# EAGLE design VIC-MIDI_v1.0a (EAGLE 5.11)
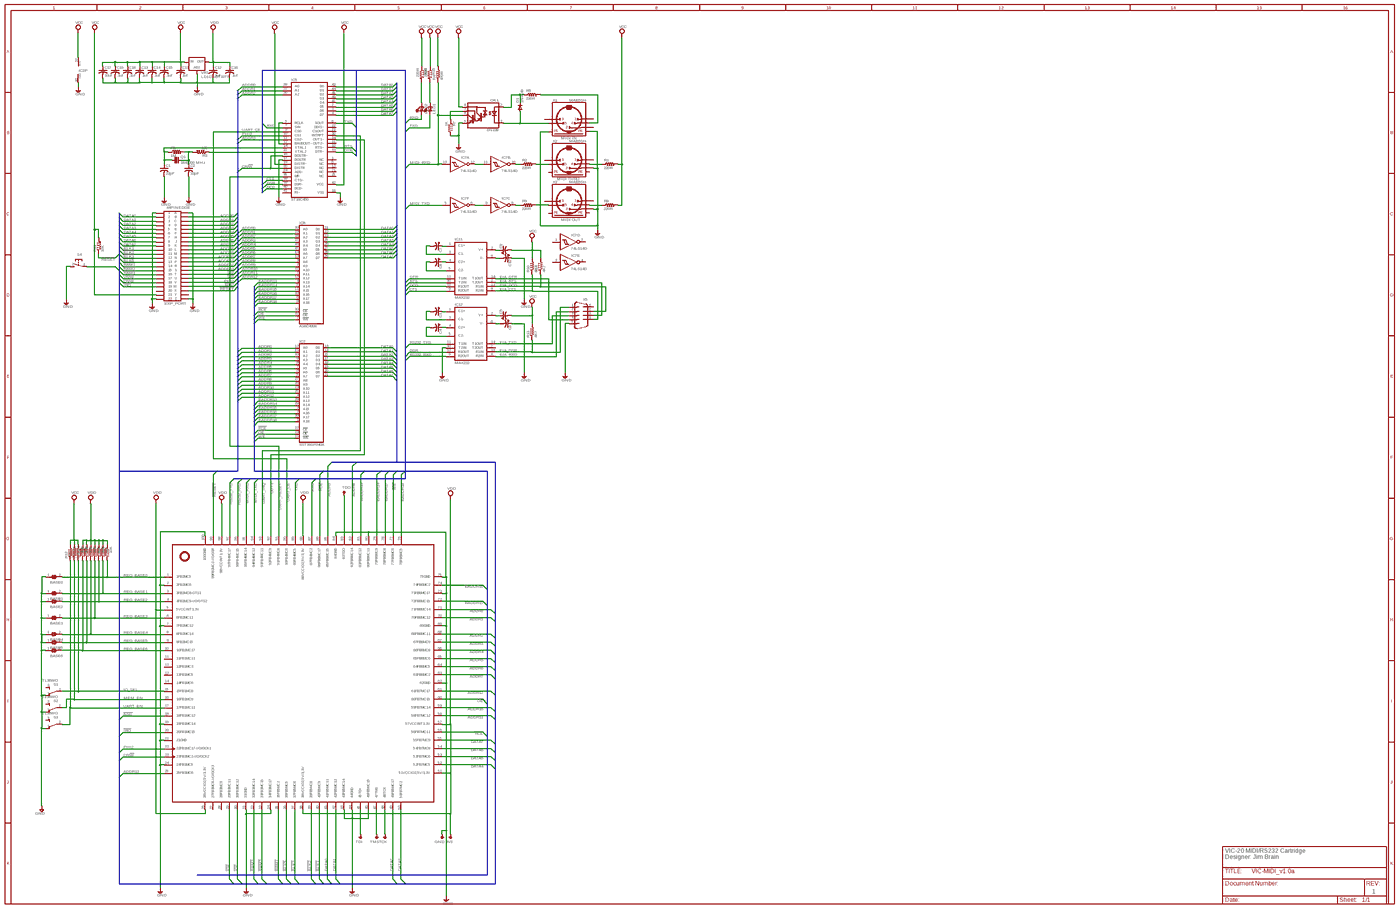
[diagram p0: schematic, sheet 1, overview]
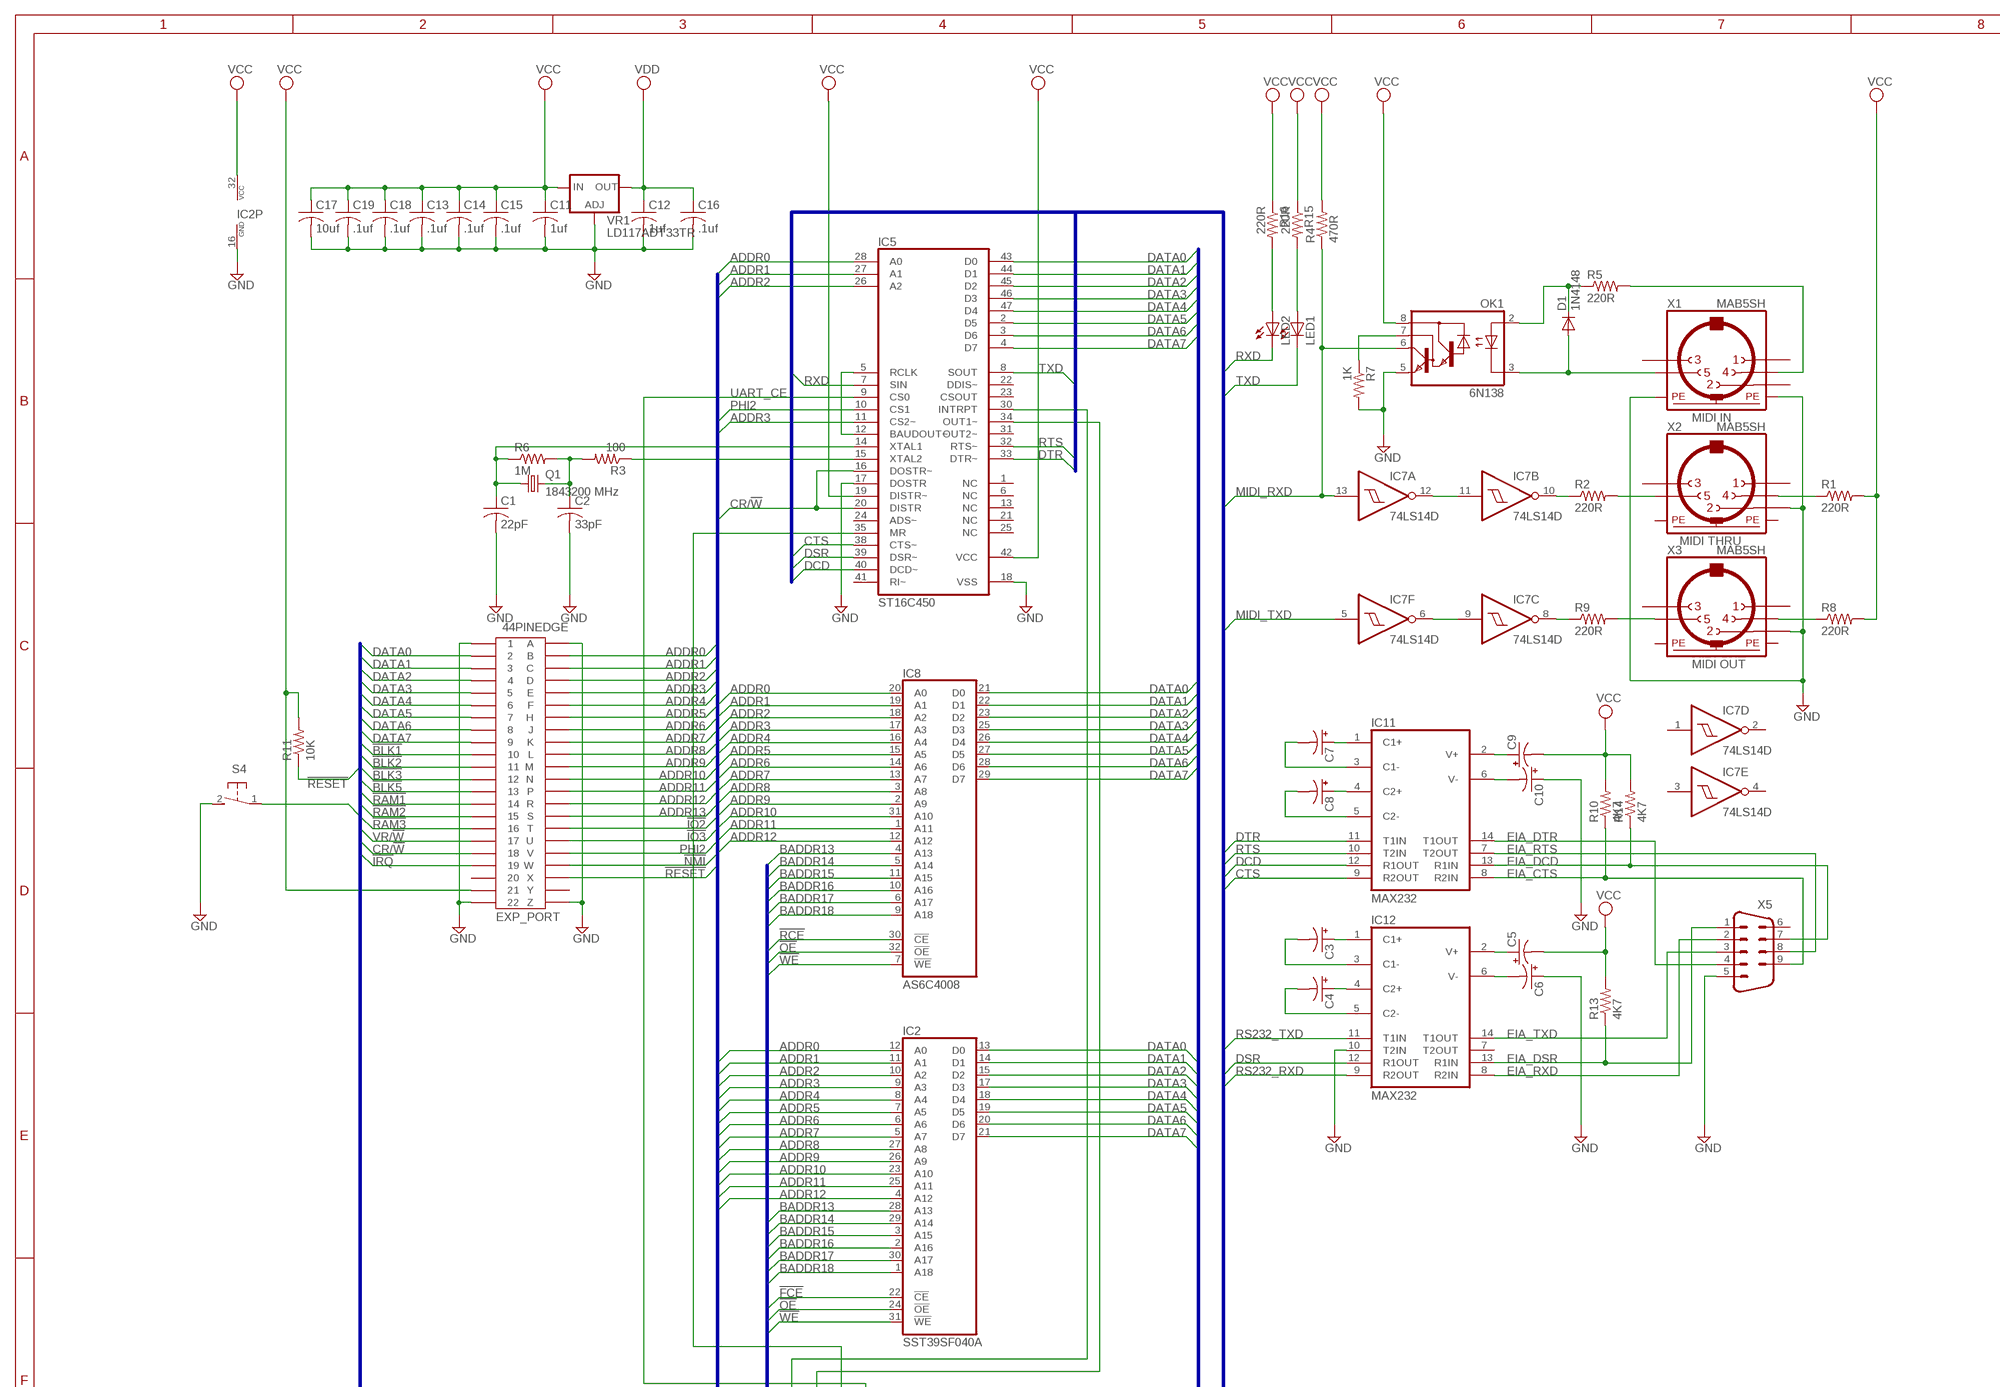
[diagram p1: schematic, sheet 1, part 1 of 4]
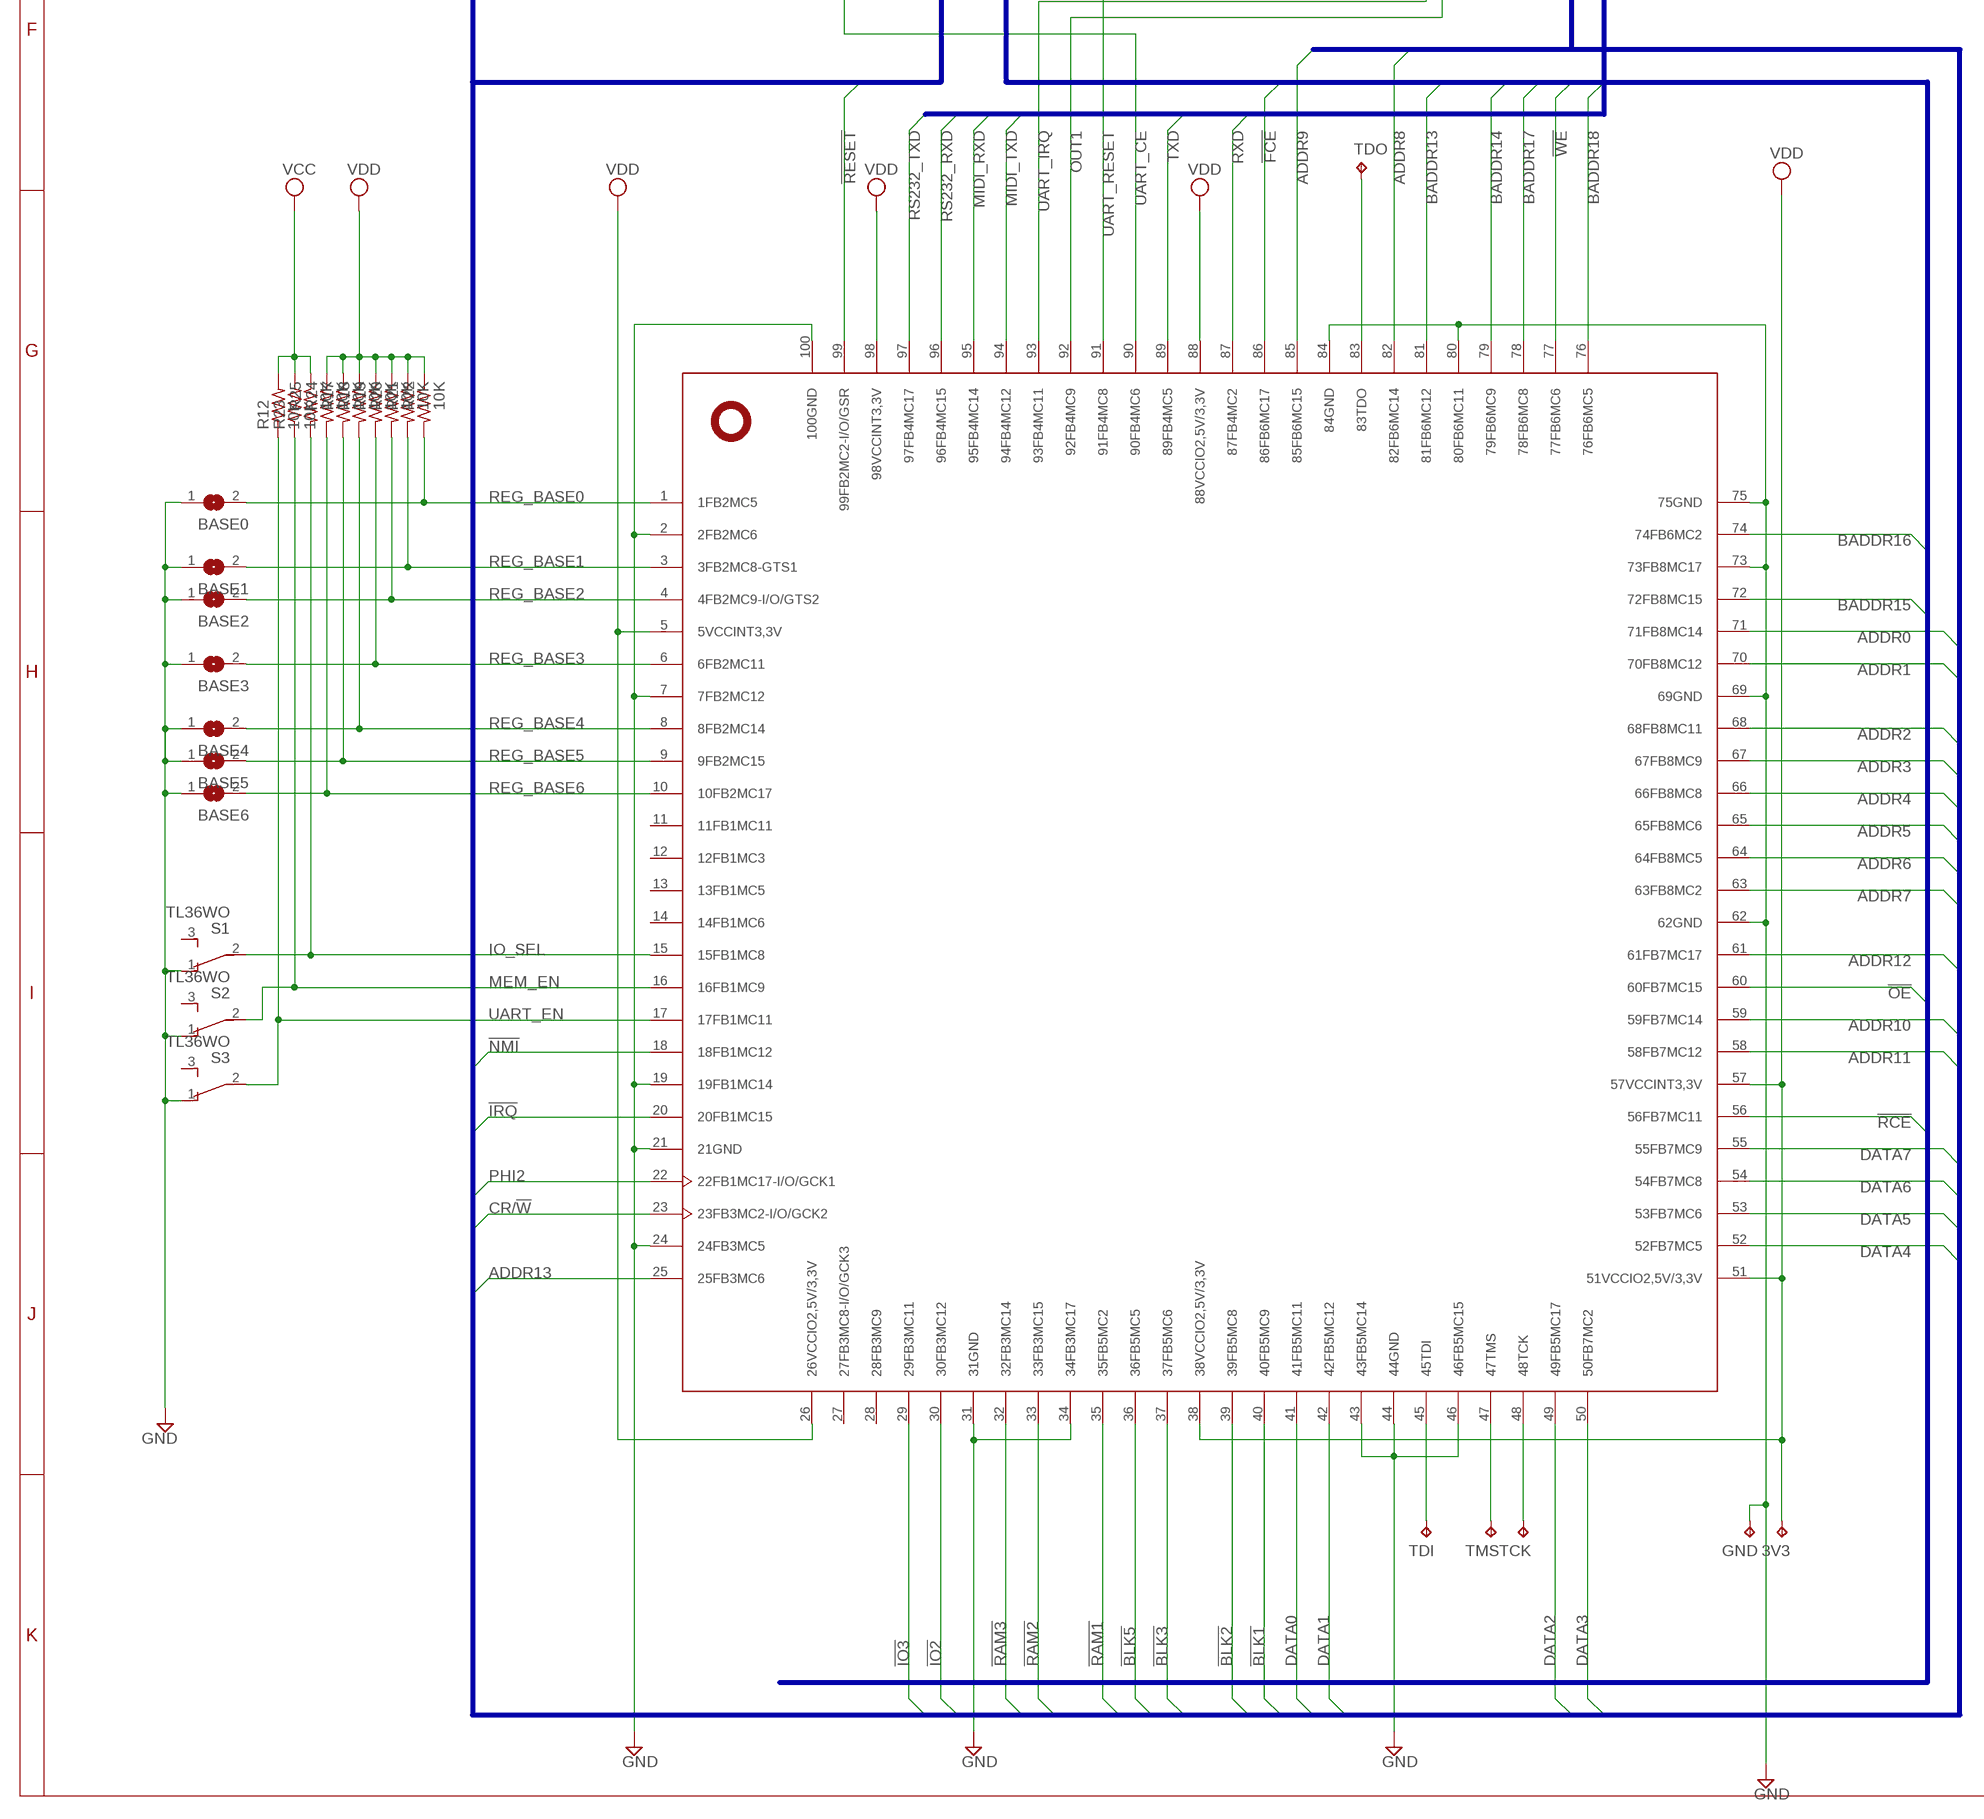
[diagram p2: schematic, sheet 1, part 2 of 4]
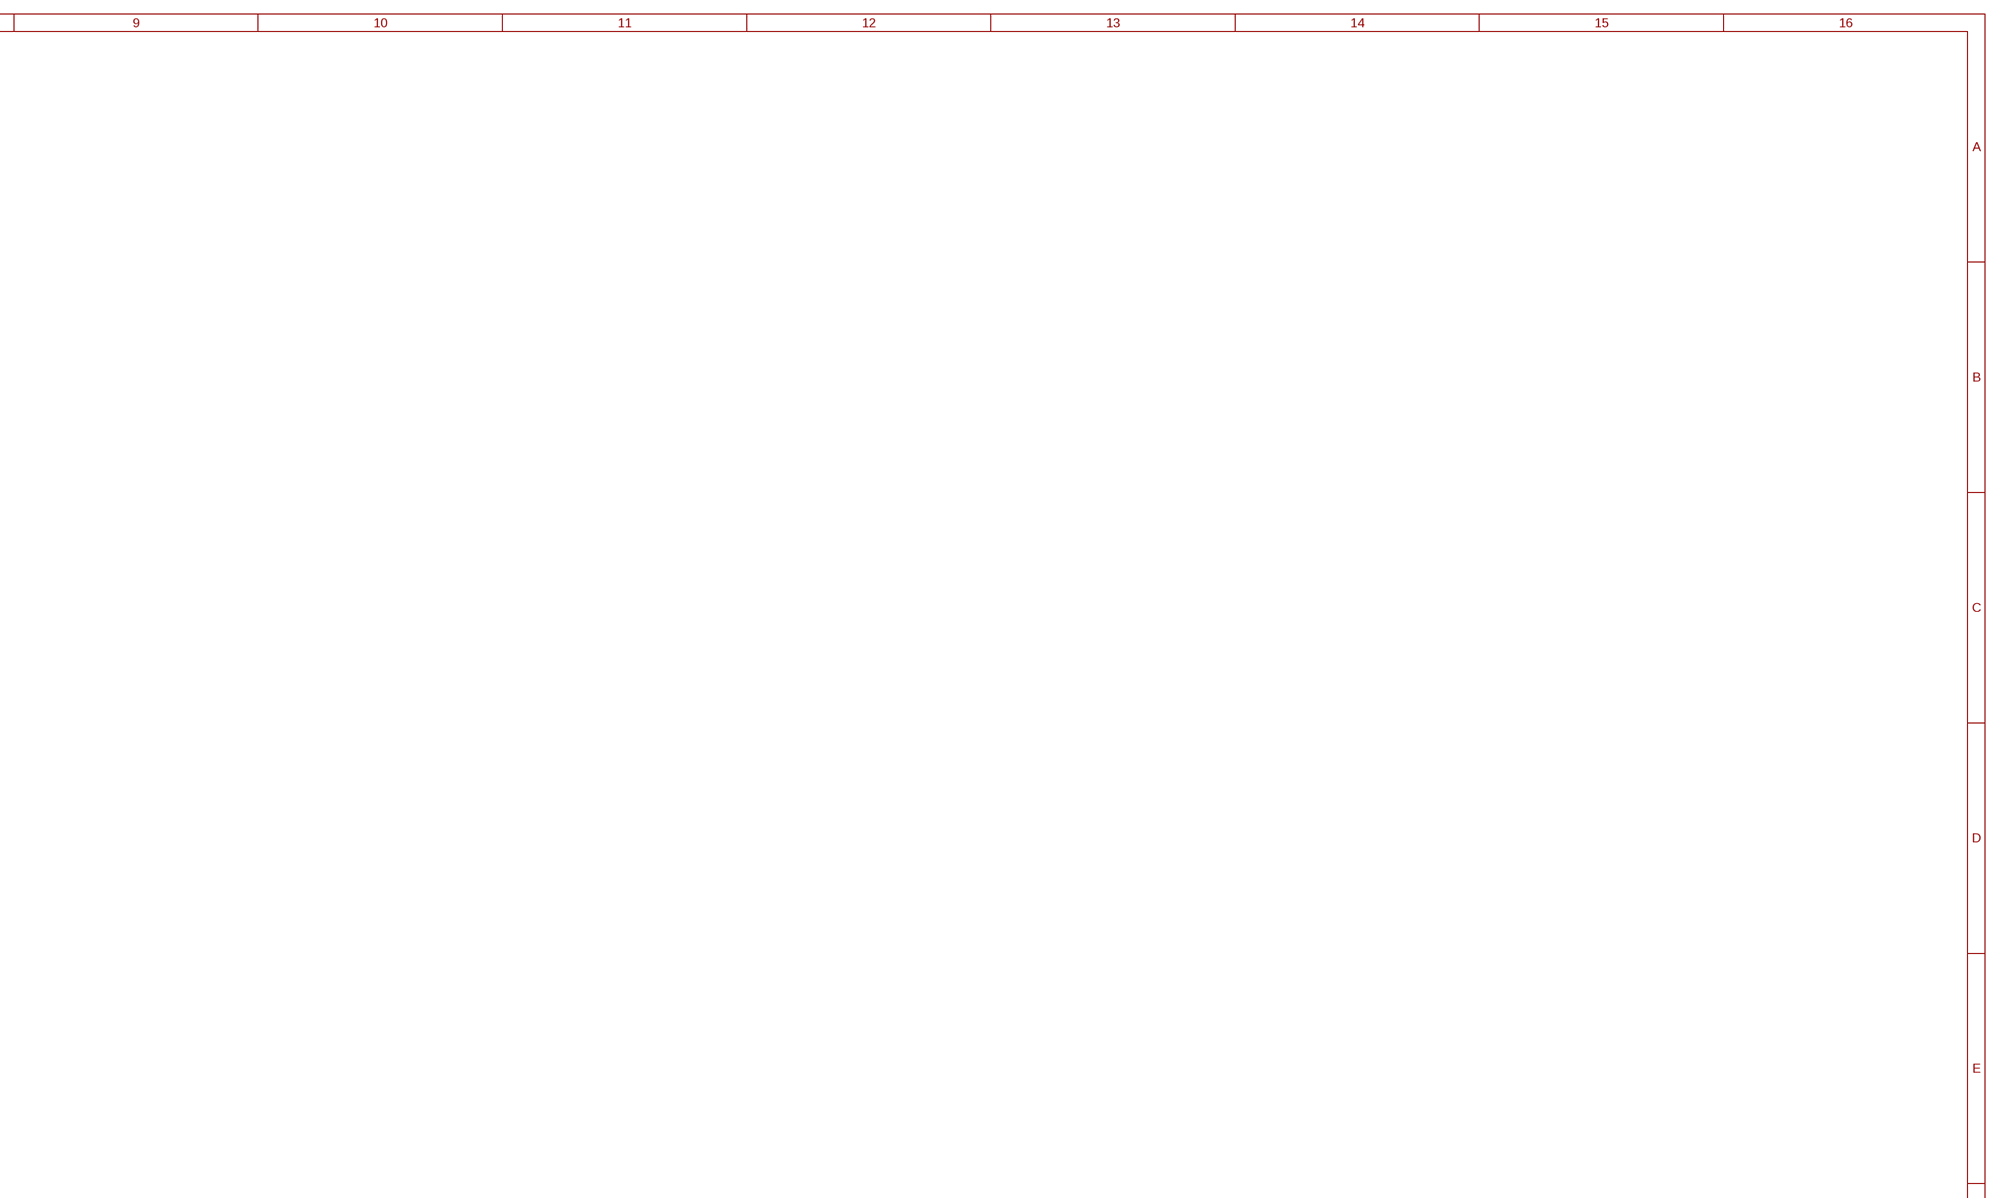
[diagram p3: schematic, sheet 1, part 3 of 4]
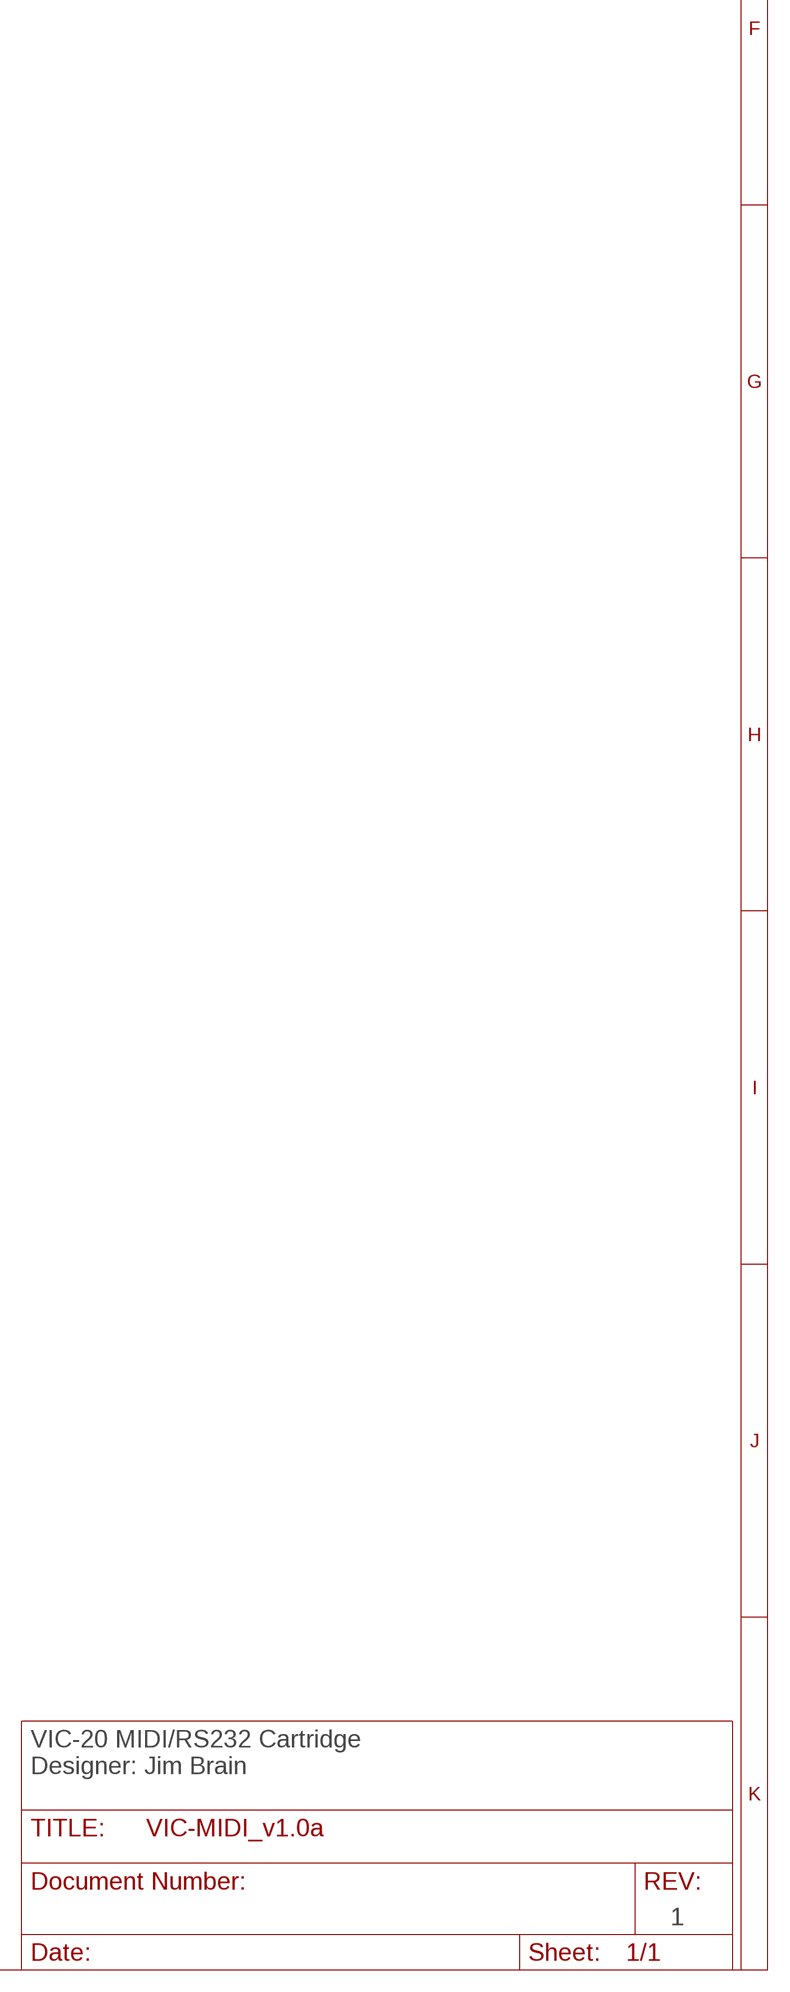
[diagram p4: schematic, sheet 1, part 4 of 4]

## Parts
3V3  TPTP08R  [TP08R]
44PINEDGE  EXP_PORT  MA-44  [MA-44]
BASE0  SJ  [SJ]
BASE1  SJ  [SJ]
BASE2  SJ  [SJ]
BASE3  SJ  [SJ]
BASE4  SJ  [SJ]
BASE5  SJ  [SJ]
BASE6  SJ  [SJ]
C1  22pF  C-USC0805  [C0805]
C2  33pF  C-USC0805  [C0805]
C3  CPOL-USE2-4  [E2-4]
C4  CPOL-USE2-4  [E2-4]
C5  CPOL-USE2-4  [E2-4]
C6  CPOL-USE2-4  [E2-4]
C7  CPOL-USE2-4  [E2-4]
C8  CPOL-USE2-4  [E2-4]
C9  CPOL-USE2-4  [E2-4]
C10  CPOL-USE2-4  [E2-4]
C11  1uf  C-USC0805  [C0805]
C12  1uf  C-USC0805  [C0805]
C13  .1uf  C-USC0805  [C0805]
C14  .1uf  C-USC0805  [C0805]
C15  .1uf  C-USC0805  [C0805]
C16  .1uf  C-USC0805  [C0805]
C17  10uf  C-USC0805  [C0805]
C18  .1uf  C-USC0805  [C0805]
C19  .1uf  C-USC0805  [C0805]
D1  1N4148  1N4148DO35-7  [DO35-7]
GND  TPTP08R  [TP08R]
IC1  XC95144XLTQG100  [TQFP100]
IC2  SST39SF040A  AM29F040J  [PLCC32R]
IC5  ST16C450  XR-16C450Q  [TQFP48]
IC7  74LS14D  [SO14]
IC8  AS6C4008  SST39VF040W  [TSOP32]
IC11  MAX232  [DIL16]
IC12  MAX232  [DIL16]
LED1  LED3MM  [LED3MM]
LED2  LED3MM  [LED3MM]
OK1  6N138  [DIL08]
Q1  1843200 MHz  CRYSTALHC49UP  [HC49UP]
R1  220R  R-US_R0805  [R0805]
R2  220R  R-US_R0805  [R0805]
R3  100  R-US_R0805  [R0805]
R4  470R  R-US_R0805  [R0805]
R5  220R  R-US_R0805  [R0805]
R6  1M  R-US_R0805  [R0805]
R7  1K  R-US_R0805  [R0805]
R8  220R  R-US_R0805  [R0805]
R9  220R  R-US_R0805  [R0805]
R10  4K7  R-US_R0805  [R0805]
R11  10K  R-US_R0805  [R0805]
R12  10K  R-US_R0805  [R0805]
R13  4K7  R-US_R0805  [R0805]
R14  4K7  R-US_R0805  [R0805]
R15  220R  R-US_R0805  [R0805]
R16  220R  R-US_R0805  [R0805]
R17  10K  R-US_M0805  [M0805]
R18  10K  R-US_M0805  [M0805]
R19  10K  R-US_M0805  [M0805]
R20  10K  R-US_M0805  [M0805]
R21  10K  R-US_M0805  [M0805]
R22  10K  R-US_M0805  [M0805]
R23  10K  R-US_R0805  [R0805]
R24  10K  R-US_M0805  [M0805]
R25  10K  R-US_M0805  [M0805]
S1  TL36WO  [TL3XWO]
S2  TL36WO  [TL3XWO]
S3  TL36WO  [TL3XWO]
S4  31-XX  [B3F-31XX]
TCK  TPTP08R  [TP08R]
TDI  TPTP08R  [TP08R]
TDO  TPTP08R  [TP08R]
TMS  TPTP08R  [TP08R]
VR1  LD117ADT33TR  [DPACK]
X1  MAB5SH  [MAB5SH]
X2  MAB5SH  [MAB5SH]
X3  MAB5SH  [MAB5SH]
X5  M09HP  [M09HP]

## Nets
!BLK1: 44PINEDGE.10 IC1.40(40FB5MC9)
!BLK2: 44PINEDGE.11 IC1.39(39FB5MC8)
!BLK3: 44PINEDGE.12 IC1.37(37FB5MC6)
!BLK5: 44PINEDGE.13 IC1.36(36FB5MC5)
!FCE: IC1.86(86FB6MC17) IC2.22(!CE)
!IO2: 44PINEDGE.T IC1.30(30FB3MC12)
!IO3: 44PINEDGE.U IC1.29(29FB3MC11)
!IRQ: 44PINEDGE.19 IC1.20(20FB1MC15)
!NMI: 44PINEDGE.W IC1.18(18FB1MC12)
!OE: IC1.60(60FB7MC15) IC2.24(!OE) IC8.32(!OE)
!RAM1: 44PINEDGE.14 IC1.35(35FB5MC2)
!RAM2: 44PINEDGE.15 IC1.33(33FB3MC15)
!RAM3: 44PINEDGE.16 IC1.32(32FB3MC14)
!RCE: IC1.56(56FB7MC11) IC8.30(!CE)
!RESET: 44PINEDGE.X IC1.99(99FB2MC2-I/O/GSR) R11.1 S4.1(P)
!WE: IC1.77(77FB6MC6) IC2.31(!WE) IC8.7(!WE)
ADDR0: 44PINEDGE.B IC1.71(71FB8MC14) IC2.12(A0) IC5.28(A0) IC8.20(A0)
ADDR1: 44PINEDGE.C IC1.70(70FB8MC12) IC2.11(A1) IC5.27(A1) IC8.19(A1)
ADDR2: 44PINEDGE.D IC1.68(68FB8MC11) IC2.10(A2) IC5.26(A2) IC8.18(A2)
ADDR3: 44PINEDGE.E IC1.67(67FB8MC9) IC2.9(A3) IC5.11(CS2~) IC8.17(A3)
ADDR4: 44PINEDGE.F IC1.66(66FB8MC8) IC2.8(A4) IC8.16(A4)
ADDR5: 44PINEDGE.H IC1.65(65FB8MC6) IC2.7(A5) IC8.15(A5)
ADDR6: 44PINEDGE.J IC1.64(64FB8MC5) IC2.6(A6) IC8.14(A6)
ADDR7: 44PINEDGE.K IC1.63(63FB8MC2) IC2.5(A7) IC8.13(A7)
ADDR8: 44PINEDGE.L IC1.82(82FB6MC14) IC2.27(A8) IC8.3(A8)
ADDR9: 44PINEDGE.M IC1.85(85FB6MC15) IC2.26(A9) IC8.2(A9)
ADDR10: 44PINEDGE.N IC1.59(59FB7MC14) IC2.23(A10) IC8.31(A10)
ADDR11: 44PINEDGE.P IC1.58(58FB7MC12) IC2.25(A11) IC8.1(A11)
ADDR12: 44PINEDGE.R IC1.61(61FB7MC17) IC2.4(A12) IC8.12(A12)
ADDR13: 44PINEDGE.S IC1.25(25FB3MC6)
BADDR13: IC1.81(81FB6MC12) IC2.28(A13) IC8.4(A13)
BADDR14: IC1.79(79FB6MC9) IC2.29(A14) IC8.5(A14)
BADDR15: IC1.72(72FB8MC15) IC2.3(A15) IC8.11(A15)
BADDR16: IC1.74(74FB6MC2) IC2.2(A16) IC8.10(A16)
BADDR17: IC1.78(78FB6MC8) IC2.30(A17) IC8.6(A17)
BADDR18: IC1.76(76FB6MC5) IC2.1(A18) IC8.9(A18)
CR/!W: 44PINEDGE.18 IC1.23(23FB3MC2-I/O/GCK2) IC5.16(DOSTR~) IC5.20(DISTR)
CTS: IC5.38(CTS~) IC11.9(R2OUT)
DATA0: 44PINEDGE.2 IC1.41(41FB5MC11) IC2.13(D0) IC5.43(D0) IC8.21(D0)
DATA1: 44PINEDGE.3 IC1.42(42FB5MC12) IC2.14(D1) IC5.44(D1) IC8.22(D1)
DATA2: 44PINEDGE.4 IC1.49(49FB5MC17) IC2.15(D2) IC5.45(D2) IC8.23(D2)
DATA3: 44PINEDGE.5 IC1.50(50FB7MC2) IC2.17(D3) IC5.46(D3) IC8.25(D3)
DATA4: 44PINEDGE.6 IC1.52(52FB7MC5) IC2.18(D4) IC5.47(D4) IC8.26(D4)
DATA5: 44PINEDGE.7 IC1.53(53FB7MC6) IC2.19(D5) IC5.2(D5) IC8.27(D5)
DATA6: 44PINEDGE.8 IC1.54(54FB7MC8) IC2.20(D6) IC5.3(D6) IC8.28(D6)
DATA7: 44PINEDGE.9 IC1.55(55FB7MC9) IC2.21(D7) IC5.4(D7) IC8.29(D7)
DCD: IC5.40(DCD~) IC11.12(R1OUT)
DSR: IC5.39(DSR~) IC12.12(R1OUT)
DTR: IC5.33(DTR~) IC11.11(T1IN)
EIA_CTS: IC11.8(R2IN) R10.1 X5.9
EIA_DCD: IC11.13(R1IN) R14.1 X5.7
EIA_DSR: IC12.13(R1IN) R13.1 X5.1
EIA_DTR: IC11.14(T1OUT) X5.4
EIA_RTS: IC11.7(T2OUT) X5.8
EIA_RXD: IC12.8(R2IN) X5.2
EIA_TXD: IC12.14(T1OUT) X5.3
GND: 44PINEDGE.1 44PINEDGE.22 44PINEDGE.A 44PINEDGE.Z BASE0.1 BASE1.1 BASE2.1 BASE3.1 BASE4.1 BASE5.1 BASE6.1 C1.2 C2.2 C6.+ C10.+ C11.2 C12.2 C13.2 C14.2 C15.2 C16.2 C17.2 C18.2 C19.2 GND.TP IC1.2(2FB2MC6) IC1.7(7FB2MC12) IC1.19(19FB1MC14) IC1.21(21GND) IC1.24(24FB3MC5) IC1.31(31GND) IC1.34(34FB3MC17) IC1.43(43FB5MC14) IC1.44(44GND) IC1.46(46FB5MC15) IC1.62(62GND) IC1.69(69GND) IC1.73(73FB8MC17) IC1.75(75GND) IC1.80(80FB6MC11) IC1.84(84GND) IC1.100(100GND) IC2.16(GND) IC5.17(DOSTR) IC5.18(VSS) IC12.10(T2IN) OK1.5(GND) R7.2 S1.1(O) S2.1(O) S3.1(O) S4.2(S) VR1.1(ADJ) X1.PE X1.PE@(PE) X2.2 X3.2 X5.5
IO_SEL: IC1.15(15FB1MC8) R25.2 S1.2(P)
MEM_EN: IC1.16(16FB1MC9) R23.1 S2.2(P)
MIDI_RXD: IC1.95(95FB4MC14) IC7.13(A:I) OK1.6(VO) R4.1
MIDI_TXD: IC1.94(94FB4MC12) IC7.5(F:I)
N$1: R9.2 X3.5
N$2: IC7.6(F:O) IC7.9(C:I)
N$3: R8.1 X3.4
N$4: IC7.8(C:O) R9.1
N$5: LED1.A R15.2
N$6: D1.C OK1.2(A) R5.1
N$7: R5.2 X1.4
N$8: D1.A OK1.3(C) X1.5
N$9: OK1.7(VB) R7.1
N$10: R2.2 X2.5
N$11: IC7.10(B:O) R2.1
N$12: IC7.11(B:I) IC7.12(A:O)
N$13: R1.1 X2.4
N$15: IC5.15(XTAL2) R3.1
N$16: C1.1 IC5.14(XTAL1) Q1.1 R6.1
N$17: C2.1 Q1.2 R3.2 R6.2
N$19: IC5.5(RCLK) IC5.12(BAUDOUT~)
N$25: LED2.A R16.2
N$27: IC1.48(48TCK) TCK.TP
N$31: IC1.47(47TMS) TMS.TP
N$32: IC1.45(45TDI) TDI.TP
N$33: IC1.83(83TDO) TDO.TP
N$36: C3.+ IC12.1(C1+)
N$37: C3.- IC12.3(C1-)
N$38: C4.+ IC12.4(C2+)
N$39: C4.- IC12.5(C2-)
N$40: C5.+ IC12.2(V+)
N$41: C6.- IC12.6(V-)
N$42: C7.+ IC11.1(C1+)
N$43: C7.- IC11.3(C1-)
N$44: C8.+ IC11.4(C2+)
N$45: C8.- IC11.5(C2-)
N$46: C9.+ IC11.2(V+)
N$47: C10.- IC11.6(V-)
OUT1: IC1.92(92FB4MC9) IC5.34(OUT1~)
PHI2: 44PINEDGE.V IC1.22(22FB1MC17-I/O/GCK1) IC5.10(CS1)
REG_BASE0: BASE0.2 IC1.1(1FB2MC5) R22.2
REG_BASE1: BASE1.2 IC1.3(3FB2MC8-GTS1) R21.2
REG_BASE2: BASE2.2 IC1.4(4FB2MC9-I/O/GTS2) R20.2
REG_BASE3: BASE3.2 IC1.6(6FB2MC11) R19.2
REG_BASE4: BASE4.2 IC1.8(8FB2MC14) R18.2
REG_BASE5: BASE5.2 IC1.9(9FB2MC15) R17.2
REG_BASE6: BASE6.2 IC1.10(10FB2MC17) R24.2
RS232_RXD: IC1.96(96FB4MC15) IC12.9(R2OUT)
RS232_TXD: IC1.97(97FB4MC17) IC12.11(T1IN)
RTS: IC5.32(RTS~) IC11.10(T2IN)
RXD: IC1.87(87FB4MC2) IC5.7(SIN) LED2.K(C)
TXD: IC1.89(89FB4MC5) IC5.8(SOUT) LED1.K(C)
UART_CE: IC1.90(90FB4MC6) IC5.9(CS0)
UART_EN: IC1.17(17FB1MC11) R12.1 S3.2(P)
UART_IRQ: IC1.93(93FB4MC11) IC5.30(INTRPT)
UART_RESET: IC1.91(91FB4MC8) IC5.35(MR)
VCC: 44PINEDGE.21 C5.- C9.- C11.1 C13.1 C14.1 C15.1 C17.1 C18.1 C19.1 IC2.32(VCC) IC5.19(DISTR~) IC5.42(VCC) OK1.8(VCC) R1.2 R4.2 R8.2 R10.2 R11.2 R12.2 R13.2 R14.2 R15.1 R16.1 R23.2 R25.1 VR1.3(IN)
VDD: 3V3.TP C12.1 C16.1 IC1.5(5VCCINT3,3V) IC1.26(26VCCIO2,5V/3,3V) IC1.38(38VCCIO2,5V/3,3V) IC1.51(51VCCIO2,5V/3,3V) IC1.57(57VCCINT3,3V) IC1.88(88VCCIO2,5V/3,3V) IC1.98(98VCCINT3,3V) R17.1 R18.1 R19.1 R20.1 R21.1 R22.1 R24.1 VR1.4(OUT)
VR/!W: 44PINEDGE.17
Unconnected: 44PINEDGE.20 44PINEDGE.Y IC1.11(11FB1MC11) IC1.12(12FB1MC3) IC1.13(13FB1MC5) IC1.14(14FB1MC6) IC1.27(27FB3MC8-I/O/GCK3) IC1.28(28FB3MC9) IC5.1(NC) IC5.6(NC) IC5.13(NC) IC5.21(NC) IC5.22(DDIS~) IC5.23(CSOUT) IC5.24(ADS~) IC5.25(NC) IC5.31(OUT2~) IC5.41(RI~) IC7.1(D:I) IC7.2(D:O) IC7.3(E:I) IC7.4(E:O) IC12.7(T2OUT) S1.3(S) S2.3(S) S3.3(S) X1.1 X1.2 X1.3 X2.1 X2.3 X3.1 X3.3 X5.6

## Buses
DATA[0..7],ADDR[0..13],VR/!W,CR/!W,!BLK1,!BLK2,!BLK3,!BLK5,!RAM1,!RAM2,!RAM3,!IRQ,!NMI,!IO2,!IO3,PHI2,!RESET
RXD,TXD,DCD,RTS,CTS,DSR,DTR,MIDI_RXD,MIDI_TXD,RS232_RXD,RS232_TXD
BADDR[13..19],!FCE,!OE,!WE,!RCE

## Notes on the sheet
- MIDI IN
- MIDI THRU
- MIDI OUT
- VIC-20 MIDI/RS232 Cartridge
- Designer: Jim Brain
- 1

## Power pins joined to a net without a drawn wire
GND: IC7.7(P:GND) IC8.24(GND) IC11.15(GND) IC12.15(GND)
PE: X2.PE X2.PE@(PE) X3.PE X3.PE@(PE)
VCC: IC7.14(P:VCC) IC8.8(VCC) IC11.16(VCC) IC12.16(VCC)

## Library data of the parts
3V3 GND TCK TDI TDO TMS = testpad:TP: Test pad
44PINEDGE = con-edge-156:MA-44: 44 PIN EDGE CONNECTOR FOR PCB
BASE0 BASE1-BASE6 = jumper:SJ: SMD solder JUMPER
C1 C2 C11-C19 = rcl:C-US: CAPACITOR, American symbol
C3-C10 = rcl:CPOL-US: POLARIZED CAPACITOR, American symbol
D1 = diode:1N4148: DIODE high speed (Philips)
IC1 = xilinx_xc95XXXxl:XC95144XLTQG100
IC2 = am29-memory:AM29F040J: 4-Megabit FLASH MEMORY (512 K x 8 bit) 5 V-only
IC5 = exar:XR-16C450Q: UART
IC7 = 74xx-us:74*14: Hex schmitt trigger INVERTER
IC8 = memory:SST39VF040: 4 Mbit x8 Multi-Purpose Flash Source: http://www.sst.com/dotAsset/40782.pdf
IC11 IC12 = maxim:MAX232: RS232 TRANSEIVER; MF: MAXIM; MPN: MAX232ACPE+; OC_FARNELL: 9723773; OC_NEWARK: 68K4544
LED1 LED2 = led:LED: LED OSRAM: - CHIPLED LG R971, LG N971, LY N971, LG Q971, LY Q971, LO R971, LY R971 LH N974, LH R974 LS Q976, LO Q976, LY Q976 LO Q996 - Hyper CHIPLED LW Q18S LB Q993, LB Q99A, LB R99A - SideLED LS A670, LO A670, LY A670, LG A670, LP A670 LB A673, LV A673, LT A673, LW A673 LH A674 LY A675 LS A676, LA A676, LO A676, LY A676, LW A676 LS A679, LY A679, LG A679 - Hyper Micro SIDELED® LS Y876, LA Y876, LO Y876, LY Y876 LT Y87S - SmartLED LW L88C, LW L88S LB L89C, LB L89S, LG L890 LS L89K, LO L89K, LY L89K LS L896, LA L896, LO L896, LY L896 - TOPLED LS T670, LO T670, LY T670, LG T670, LP T670 LSG T670, LSP T670, LSY T670, LOP T670, LYG T670 LG T671, LOG T671, LSG T671 LB T673, LV T673, LT T673, LW T673 LH T674 LS T676, LA T676, LO T676, LY T676, LB T676, LH T676, LSB T676, LW T676 LB T67C, LV T67C, LT T67C, LS T67K, LO T67K, LY T67K, LW E67C LS E67B, LA E67B, LO E67B, LY E67B, LB E67C, LV E67C, LT E67C LW T67C LS T679, LY T679, LG T679 LS T770, LO T770, LY T770, LG T770, LP T770 LB T773, LV T773, LT T773, LW T773 LH T774 LS E675, LA E675, LY E675, LS T675 LS T776, LA T776, LO T776, LY T776, LB T776 LHGB T686 LT T68C, LB T68C - Hyper Mini TOPLED® LB M676 - Mini TOPLED Santana® LG M470 LS M47K, LO M47K, LY M47K Source: http://www.osram.convergy.de LUXEON: - LUMILED® LXK2-PW12-R00, LXK2-PW12-S00, LXK2-PW14-U00, LXK2-PW14-V00 LXK2-PM12-R00, LXK2-PM12-S00, LXK2-PM14-U00 LXK2-PE12-Q00, LXK2-PE12-R00, LXK2-PE12-S00, LXK2-PE14-T00, LXK2-PE14-U00 LXK2-PB12-K00, LXK2-PB12-L00, LXK2-PB12-M00, LXK2-PB14-N00, LXK2-PB14-P00, LXK2-PB14-Q00 LXK2-PR12-L00, LXK2-PR12-M00, LXK2-PR14-Q00, LXK2-PR14-R00 LXK2-PD12-Q00, LXK2-PD12-R00, LXK2-PD12-S00 LXK2-PH12-R00, LXK2-PH12-S00 LXK2-PL12-P00, LXK2-PL12-Q00, LXK2-PL12-R00 Source: www.luxeon.com KINGBRIGHT: KA-3528ASYC Source: www.kingbright.com
OK1 = optocoupler:6N138: MOTOROLA OPTO COUPLER; MF: VISHAY/TELEFUNKEN; MPN: 6N138; OC_FARNELL: 9860150; OC_NEWARK: 35K5294
Q1 = crystal:CRYSTAL: CRYSTAL; OC_FARNELL: unknown; OC_NEWARK: unknown
R1-R9 R11 R12 R15-R25 = resistor:R-US_: RESISTOR, American symbol
R10 R13 R14 = rcl:R-US_: RESISTOR, American symbol
S1-S3 = switch:TL36WO: TINY SWITCH ON - ON Source: http://www2.produktinfo.conrad.com/datenblaetter/700000-724999/705152-da-01-de-Subminiaturschalter_TL_36WO.pdf
S4 = switch-omron:31-XX: OMRON SWITCH; MPN: B3F-3100; OC_FARNELL: 959704; OC_NEWARK: 36M3582
VR1 = v-reg:LD117A?*: Low drop fixed and adjustable positive voltage regulators 1 A Source: http://www.st.com/stonline/products/literature/ds/7194/ld1117axx.pdf
X1-X3 = con-hirschmann:MAB5SH: Female CONNECTOR 5 pins 90 deg. with shield, horizontal (DIN 41524); OC_FARNELL: 809883; OC_NEWARK: unknown
X5 = con-subd:M09: SUB-D; OC_FARNELL: unknown; OC_NEWARK: unknown

## Board
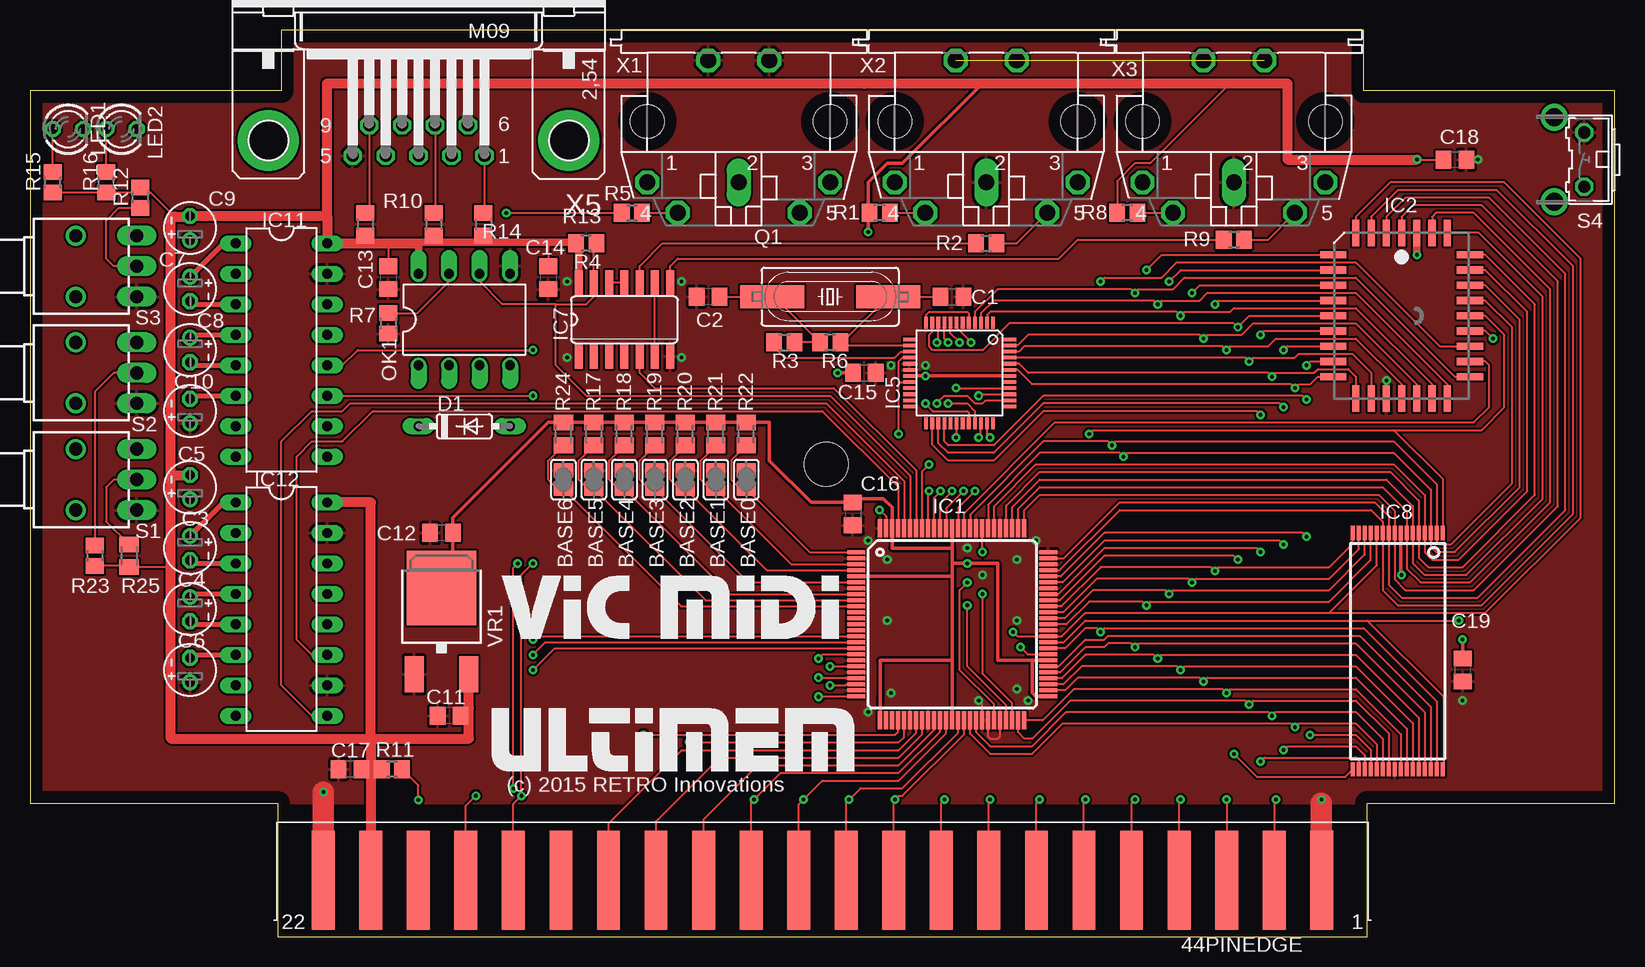
[diagram p5: board, top side]
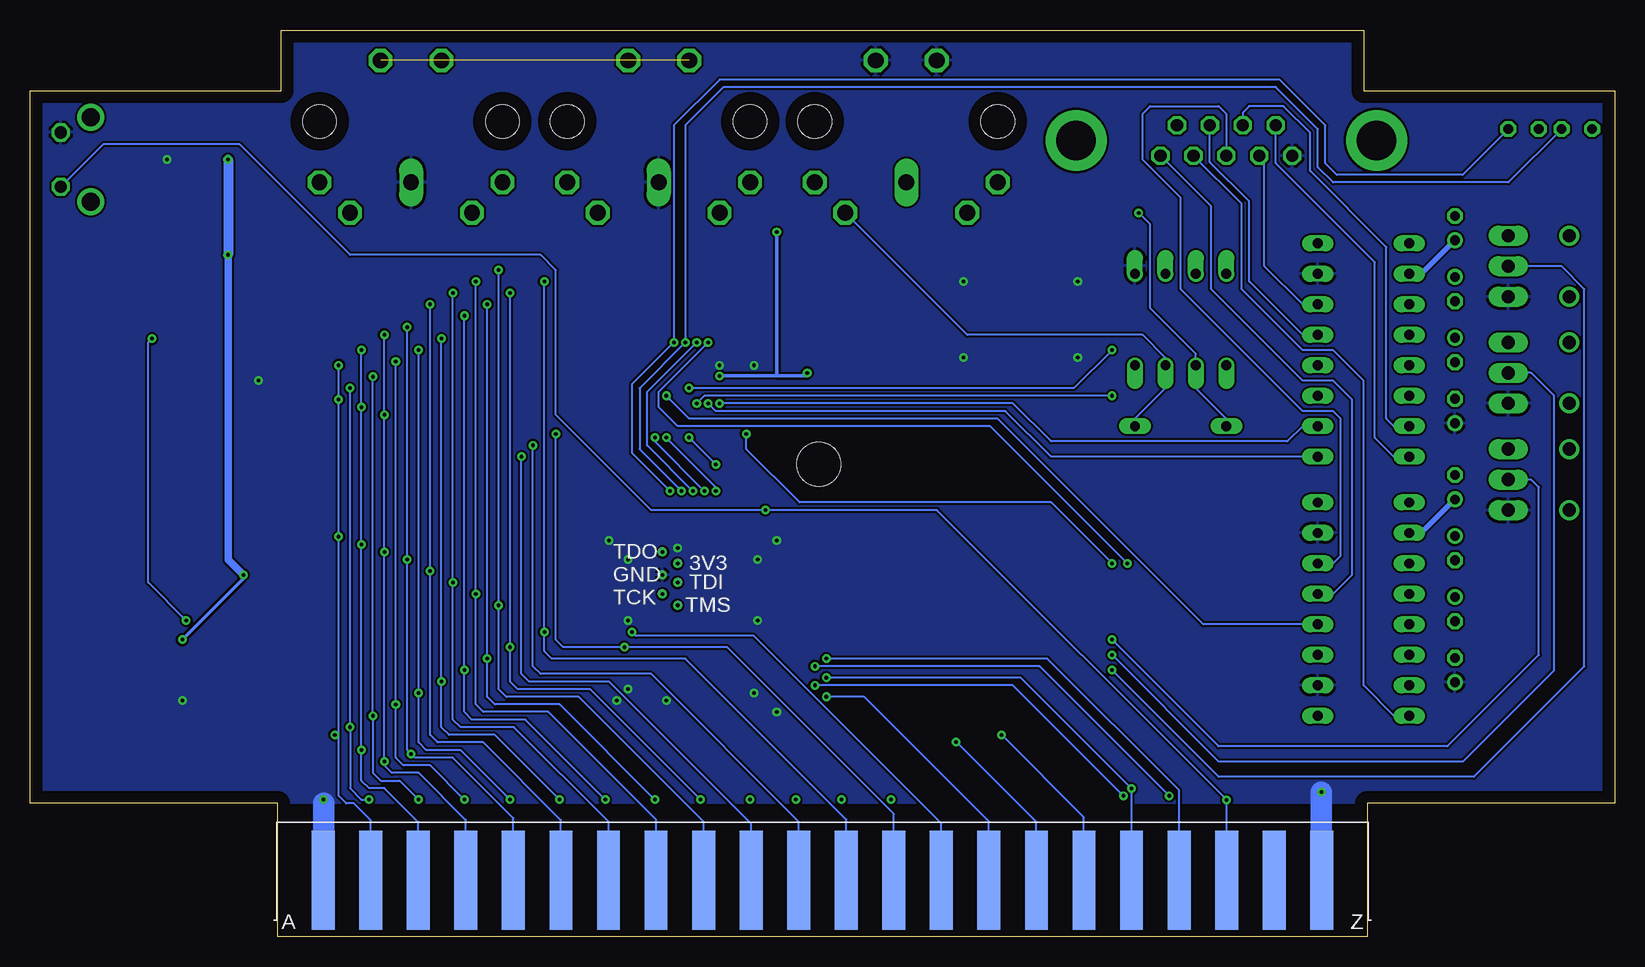
[diagram p6: board, bottom side, seen from below]

Size 132.08 x 75.56 mm. Coordinates in mm from the lower left corner, seen from the top.
Outline: 20.64,0 111.44,0 111.44,11.11 132.08,11.11 132.08,70.48 111.12,70.48 111.12,75.56 20.95,75.56 20.95,70.48 0,70.48 0,11.11 20.64,11.11 20.64,0
Copper layers (1*16): Top 0.035mm / dielectric 1.5mm / Bottom 0.035mm
Design rules "ourpcb-small *": minimum track width 4mil, minimum drill 12mil, track to track 5mil, track to pad 5mil, pad to pad 5mil, via to via 5mil, smd to smd 0mil, copper to edge 40mil, drill to drill 8mil, minimum pad ring 10mil, minimum via ring 8mil, stop-mask expansion 4mil, vias tented up to drill 0mil, thermal gap 10mil
Holes 3.64 mm at 66.36,39.37

### Footprints (pad centres in the part's own frame; a part is rotated, then mirrored left to right if it is on the bottom)
TP08R = smd 0.8 x 0.8: TP 0,0
MA-44 = smd 1.905 x 8.255: 1 -41.605,4.826; 2 -37.643,4.826; 3 -33.68,4.826; 4 -29.718,4.826; 5 -25.756,4.826; 6 -21.793,4.826; 7 -17.831,4.826; 8 -13.868,4.826; 9 -9.906,4.826; 10 -5.944,4.826; 11 -1.981,4.826; 12 1.981,4.826; 13 5.944,4.826; 14 9.906,4.826; 15 13.868,4.826; 16 17.831,4.826; 17 21.793,4.826; 18 25.756,4.826; 19 29.718,4.826; 20 33.68,4.826; 21 37.643,4.826; 22 41.605,4.826 | smd 1.905 x 8.255 bottom: A -41.605,4.826; B -37.643,4.826; C -33.68,4.826; D -29.718,4.826; E -25.756,4.826; F -21.793,4.826; H -17.831,4.826; J -13.868,4.826; K -9.906,4.826; L -5.944,4.826; M -1.981,4.826; N 1.981,4.826; P 5.944,4.826; R 9.906,4.826; S 13.868,4.826; T 17.831,4.826; U 21.793,4.826; V 25.756,4.826; W 29.718,4.826; X 33.68,4.826; Y 37.643,4.826; Z 41.605,4.826
SJ = smd 1.168 x 1.6: 1 -0.762,0; 2 0.762,0
C0805 = smd 1.3 x 1.5: 1 -0.95,0; 2 0.95,0
E2-4 = drill 0.813 pad 1.27 round: + -1.016,0 | drill 0.813 pad 1.27 octagon: - 1.016,0
DO35-7 = drill 0.813 long: A 3.81,0; C -3.81,0
TQFP100 = smd 1.5 x 0.35: 1 -8,6; 2 -8,5.5; 3 -8,5; 4 -8,4.5; 5 -8,4; 6 -8,3.5; 7 -8,3; 8 -8,2.5; 9 -8,2; 10 -8,1.5; 11 -8,1; 12 -8,0.5; 13 -8,0; 14 -8,-0.5; 15 -8,-1; 16 -8,-1.5; 17 -8,-2; 18 -8,-2.5; 19 -8,-3; 20 -8,-3.5; 21 -8,-4; 22 -8,-4.5; 23 -8,-5; 24 -8,-5.5; 25 -8,-6; 51 8,-6; 52 8,-5.5; 53 8,-5; 54 8,-4.5; 55 8,-4; 56 8,-3.5; 57 8,-3; 58 8,-2.5; 59 8,-2; 60 8,-1.5; 61 8,-1; 62 8,-0.5; 63 8,0; 64 8,0.5; 65 8,1; 66 8,1.5; 67 8,2; 68 8,2.5; 69 8,3; 70 8,3.5; 71 8,4; 72 8,4.5; 73 8,5; 74 8,5.5; 75 8,6 | smd 0.35 x 1.5: 26 -6,-8; 27 -5.5,-8; 28 -5,-8; 29 -4.5,-8; 30 -4,-8; 31 -3.5,-8; 32 -3,-8; 33 -2.5,-8; 34 -2,-8; 35 -1.5,-8; 36 -1,-8; 37 -0.5,-8; 38 0,-8; 39 0.5,-8; 40 1,-8; 41 1.5,-8; 42 2,-8; 43 2.5,-8; 44 3,-8; 45 3.5,-8; 46 4,-8; 47 4.5,-8; 48 5,-8; 49 5.5,-8; 50 6,-8; 76 6,8; 77 5.5,8; 78 5,8; 79 4.5,8; 80 4,8; 81 3.5,8; 82 3,8; 83 2.5,8; 84 2,8; 85 1.5,8; 86 1,8; 87 0.5,8; 88 0,8; 89 -0.5,8; 90 -1,8; 91 -1.5,8; 92 -2,8; 93 -2.5,8; 94 -3,8; 95 -3.5,8; 96 -4,8; 97 -4.5,8; 98 -5,8; 99 -5.5,8; 100 -6,8
PLCC32R = smd 0.6 x 2.2: 1 0,6.9; 2 -1.27,6.9; 3 -2.54,6.9; 4 -3.81,6.9; 14 -3.81,-6.9; 15 -2.54,-6.9; 16 -1.27,-6.9; 17 0,-6.9; 18 1.27,-6.9; 19 2.54,-6.9; 20 3.81,-6.9; 30 3.81,6.9; 31 2.54,6.9; 32 1.27,6.9 | smd 2.2 x 0.6: 5 -5.7,5.08; 6 -5.7,3.81; 7 -5.7,2.54; 8 -5.7,1.27; 9 -5.7,0; 10 -5.7,-1.27; 11 -5.7,-2.54; 12 -5.7,-3.81; 13 -5.7,-5.08; 21 5.7,-5.08; 22 5.7,-3.81; 23 5.7,-2.54; 24 5.7,-1.27; 25 5.7,0; 26 5.7,1.27; 27 5.7,2.54; 28 5.7,3.81; 29 5.7,5.08
TQFP48 = smd 1.016 x 0.305: 1 -4.191,2.794; 2 -4.191,2.286; 3 -4.191,1.778; 4 -4.191,1.27; 5 -4.191,0.762; 6 -4.191,0.254; 7 -4.191,-0.254; 8 -4.191,-0.762; 9 -4.191,-1.27; 10 -4.191,-1.778; 11 -4.191,-2.286; 12 -4.191,-2.794; 25 4.191,-2.794; 26 4.191,-2.286; 27 4.191,-1.778; 28 4.191,-1.27; 29 4.191,-0.762; 30 4.191,-0.254; 31 4.191,0.254; 32 4.191,0.762; 33 4.191,1.27; 34 4.191,1.778; 35 4.191,2.286; 36 4.191,2.794 | smd 0.305 x 1.016: 13 -2.794,-4.191; 14 -2.286,-4.191; 15 -1.778,-4.191; 16 -1.27,-4.191; 17 -0.762,-4.191; 18 -0.254,-4.191; 19 0.254,-4.191; 20 0.762,-4.191; 21 1.27,-4.191; 22 1.778,-4.191; 23 2.286,-4.191; 24 2.794,-4.191; 37 2.794,4.191; 38 2.286,4.191; 39 1.778,4.191; 40 1.27,4.191; 41 0.762,4.191; 42 0.254,4.191; 43 -0.254,4.191; 44 -0.762,4.191; 45 -1.27,4.191; 46 -1.778,4.191; 47 -2.286,4.191; 48 -2.794,4.191
SO14 = smd 0.66 x 2.032: 1 -3.81,-3.073; 2 -2.54,-3.073; 3 -1.27,-3.073; 4 0,-3.073; 5 1.27,-3.073; 6 2.54,-3.073; 7 3.81,-3.073; 8 3.81,3.073; 9 2.54,3.073; 10 1.27,3.073; 11 0,3.073; 12 -1.27,3.073; 13 -2.54,3.073; 14 -3.81,3.073
TSOP32 = smd 1.2 x 0.36: 1 -9.85,3.75; 2 -9.85,3.25; 3 -9.85,2.75; 4 -9.85,2.25; 5 -9.85,1.75; 6 -9.85,1.25; 7 -9.85,0.75; 8 -9.85,0.25; 9 -9.85,-0.25; 10 -9.85,-0.75; 11 -9.85,-1.25; 12 -9.85,-1.75; 13 -9.85,-2.25; 14 -9.85,-2.75; 15 -9.85,-3.25; 16 -9.85,-3.75; 17 9.85,-3.75; 18 9.85,-3.25; 19 9.85,-2.75; 20 9.85,-2.25; 21 9.85,-1.75; 22 9.85,-1.25; 23 9.85,-0.75; 24 9.85,-0.25; 25 9.85,0.25; 26 9.85,0.75; 27 9.85,1.25; 28 9.85,1.75; 29 9.85,2.25; 30 9.85,2.75; 31 9.85,3.25; 32 9.85,3.75
DIL16 = drill 0.813 long: 1 -8.89,-3.81; 2 -6.35,-3.81; 3 -3.81,-3.81; 4 -1.27,-3.81; 5 1.27,-3.81; 6 3.81,-3.81; 7 6.35,-3.81; 8 8.89,-3.81; 9 8.89,3.81; 10 6.35,3.81; 11 3.81,3.81; 12 1.27,3.81; 13 -1.27,3.81; 14 -3.81,3.81; 15 -6.35,3.81; 16 -8.89,3.81
LED3MM = drill 0.813 octagon: A -1.27,0; K 1.27,0
DIL08 = drill 0.813 offset: 1 -3.81,-3.81; 2 -1.27,-3.81; 3 1.27,-3.81; 4 3.81,-3.81; 5 3.81,3.81; 6 1.27,3.81; 7 -1.27,3.81; 8 -3.81,3.81
HC49UP = smd 5.334 x 1.93: 1 -4.826,0; 2 4.826,0
R0805 = smd 1.3 x 1.5: 1 -0.85,0; 2 0.85,0
R0805' = smd 1.3 x 1.5: 1 -0.95,0; 2 0.95,0
M0805 = smd 1.3 x 1.6: 1 -0.95,0; 2 0.95,0
TL3XWO = drill 1.1 pad 1.422 long: 1 -2.54,-5.08; 2 0,-5.08; 3 2.54,-5.08 | drill 1.1 pad 1.676 round: M1 -2.54,0; M2 2.54,0
B3F-31XX = drill 1.016 octagon: 1 -2.261,-1.245; 2 2.261,-1.245 | drill 1.499 pad 2.159 round: 3 -3.505,1.245; 4 3.505,1.245
DPACK = smd 1.6 x 3: 1 -2.28,-4.8; 3 2.28,-4.8 | smd 5.8 x 6.2: 4 0,2.38
MAB5SH = drill 1.321 octagon: 1 7.62,5.08; 3 -7.62,5.08; 4 5.08,7.62; 5 -5.08,7.62; PE -2.54,-5.08; PE@ 2.54,-5.08 | drill 1.321 long: 2 0,5.08 | hole 2.794: 7.62,0; -7.62,0
M09HP = drill 1.016 octagon: 1 -5.486,1.27; 2 -2.743,1.27; 3 0,1.27; 4 2.743,1.27; 5 5.486,1.27; 6 -4.115,-1.27; 7 -1.372,-1.27; 8 1.372,-1.27; 9 4.115,-1.27 | drill 3.302 pad 5.08 round: G1 -12.522,0; G2 12.522,0

### Placement (x,y rotation side)
3V3  78.1,31.11 0 bottom
44PINEDGE  66.04,9.53 180 top
BASE0  59.69,38.1 270 top
BASE1  57.15,38.1 270 top
BASE2  54.61,38.1 270 top
BASE3  52.07,38.1 270 top
BASE4  49.53,38.1 270 top
BASE5  46.99,38.1 270 top
BASE6  44.45,38.1 270 top
C1  76.83,53.34 0 top
C2  56.52,53.34 180 top
C3  13.34,32.38 270 top
C4  13.34,27.3 270 top
C5  13.34,37.47 90 top
C6  13.34,22.23 90 top
C7  13.34,53.98 270 top
C8  13.34,48.9 270 top
C9  13.34,59.05 90 top
C10  13.34,43.81 90 top
C11  34.93,18.41 180 top
C12  34.29,33.66 180 top
C13  29.84,54.93 270 top
C14  43.18,54.93 270 top
C15  69.53,46.99 0 top
C16  68.58,35.24 270 top
C17  26.67,13.97 180 top
C18  118.74,64.77 0 top
C19  119.38,22.23 270 top
D1  36.2,42.55 0 top
GND  79.38,30.16 0 bottom
IC1  76.83,26.04 0 top
IC2  114.3,51.75 0 top
IC5  77.47,46.99 270 top
IC7  49.53,51.44 0 top
IC8  113.98,23.81 270 top
IC11  20.95,48.9 270 top
IC12  20.95,27.3 270 top
LED1  3.17,67.31 0 top
LED2  7.62,67.31 0 top
OK1  36.2,51.44 0 top
Q1  66.67,53.34 180 top
R1  70.8,60.33 180 top
R2  79.69,57.78 0 top
R3  62.87,49.53 0 top
R4  46.36,57.78 180 top
R5  50.16,60.33 0 top
R6  66.67,49.53 180 top
R7  29.84,51.12 270 top
R8  91.44,60.33 180 top
R9  100.33,58.1 0 top
R10  4K7  [R0805']  27.94,59.37 270 top
R11  30.16,13.97 180 top
R12  9.21,61.59 90 top
R13  4K7  [R0805']  37.78,59.37 270 top
R14  4K7  [R0805']  33.66,59.37 270 top
R15  1.91,62.87 90 top
R16  6.35,62.87 90 top
R17  46.99,41.91 270 top
R18  49.53,41.91 270 top
R19  52.07,41.91 270 top
R20  54.61,41.91 270 top
R21  57.15,41.91 270 top
R22  59.69,41.91 270 top
R23  5.4,31.75 270 top
R24  44.45,41.91 270 top
R25  8.26,31.75 90 top
S1  3.81,38.1 90 top
S2  3.81,46.99 90 top
S3  3.81,55.88 90 top
S4  128.27,64.77 90 top
TCK  79.38,28.57 0 bottom
TDI  78.1,29.53 0 bottom
TDO  79.38,32.07 0 bottom
TMS  78.1,27.62 0 bottom
VR1  34.29,26.67 0 top
X1  59.05,67.94 180 top
X2  79.69,67.94 180 top
X3  100.33,67.94 180 top
X5  32.39,66.36 180 top

### Tracks (layer width: path | path; a pad name or v marks a point on that pad's centre or on a via)
!BLK1  (via drill 0.3)
  Top 0.152: 44PINEDGE.10 71.98,11.34 v72.07,11.43 72.39,11.75 72.71,11.75 77.83,16.88 IC1.40
!BLK2  (via drill 0.3)
  Top 0.152: 44PINEDGE.11 68.02,11.19 v68.26,11.43 69.21,12.38 72.71,12.38 77.33,17.01 IC1.39
!BLK3  (via drill 0.3)
  Top 0.152: 44PINEDGE.12 64.06,11.04 v64.45,11.43 66.04,13.02 72.39,13.02 76.33,16.96 IC1.37
!BLK5  (via drill 0.3)
  Top 0.152: 44PINEDGE.13 60.1,11.2 v60.33,11.43 62.55,13.65 72.39,13.65 75.83,17.1 IC1.36
!FCE
  Top 0.152: IC2.22 121.28,47.94 121.6,47.62 121.6,44.13 120.33,42.86 85.41,42.86 77.83,35.29 IC1.86
!IO2  (via drill 0.3)
  Top 0.152: v54.9,16.22 54.93,16.19 72.39,16.19 72.83,16.64 IC1.30
  Bottom 0.152: 44PINEDGE.T 48.21,9.58 54.85,16.22 v54.9,16.22
!IO3  (via drill 0.3)
  Top 0.152: v51.12,16.83 72.07,16.83 72.33,17.09 IC1.29
  Bottom 0.152: 44PINEDGE.U 44.25,9.96 v51.12,16.83
!IRQ  (via drill 0.3)
  Top 0.152: 44PINEDGE.19 36.32,10.92 v37.15,11.75 | IC1.20 68.83,22.54 v66.67,22.54
  Bottom 0.152: v37.15,11.75 47.94,22.54 v66.67,22.54
!NMI  (via drill 0.3)
  Top 0.152: IC1.18 66.08,23.54 v65.72,23.18
  Bottom 0.152: 44PINEDGE.W 36.32,12.19 47.31,23.18 v65.72,23.18
!OE  (via drill 0.3)
  Top 0.152: 111.44,26.35 87.95,26.35 86.13,24.54 IC1.60 | 111.44,26.35 117.79,20 117.79,14.02 IC8.32 | IC2.24 121.28,50.48 v121.92,49.85 | 111.44,26.35 v119.06,26.35
  Bottom 0.152: v121.92,49.85 122.24,49.53 122.24,29.53 v119.06,26.35
!RAM1
  Top 0.152: 44PINEDGE.14 56.13,9.78 60.64,14.29 72.39,14.29 75.33,17.23 IC1.35
!RAM2
  Top 0.152: 44PINEDGE.15 52.17,9.63 57.47,14.92 72.39,14.92 74.33,16.87 IC1.33
!RAM3
  Top 0.152: 44PINEDGE.16 48.21,9.47 54.29,15.56 72.39,15.56 73.83,17 IC1.32
!RCE
  Top 0.152: IC8.30 116.73,19.16 110.81,25.08 89.85,25.08 89.53,24.77 87.95,24.77 85.72,22.54 IC1.56
!RESET  (via drill 0.3)
  Top 0.152: IC1.99 71.33,35.03 v70.8,35.56 | v32.36,11.4 32.36,12.62 R11.1
  Bottom 0.152: S4.1 125.98,66.04 114.62,66.04 105.41,56.83 89.53,56.83 88.27,55.56 88.27,43.5 80.33,35.56 v70.8,35.56 56.52,35.56 v32.36,11.4 44PINEDGE.X
!WE
  Top 0.152: IC2.31 116.84,60.01 117.16,60.33 120.33,60.33 126.68,53.98 126.68,36.2 120.02,29.53 115.89,29.53 114.73,30.68 IC8.7 114.73,35.45 112.71,37.47 84.14,37.47 82.33,35.66 IC1.77
ADDR0  (via drill 0.3)
  Top 0.152: IC8.20 111.73,15.59 110.49,16.83 v106.68,16.83 | IC2.12 106.68,47.94 v106.36,47.62 | v106.36,33.34 106.05,33.66 89.53,33.66 85.91,30.04 IC1.71 | IC5.28 76.2,41.27 76.52,40.96 80.33,40.96 84.45,45.09 106.05,45.09 v106.36,44.77
  Bottom 0.152: 44PINEDGE.B 103.68,9.7 105.09,11.11 105.73,11.11 106.36,11.75 106.36,16.51 | 106.36,16.51 v106.36,33.34 v106.36,44.77 v106.36,47.62 | 106.36,16.51 v106.68,16.83
ADDR1  (via drill 0.3)
  Top 0.152: IC8.19 111.23,15.13 110.49,15.88 104.77,15.88 v104.46,15.56 | IC2.11 104.77,49.21 v104.46,48.9 | v104.46,32.7 104.14,33.02 89.53,33.02 86.05,29.54 IC1.70 | IC5.27 75.69,41.15 76.52,40.32 80.33,40.32 84.45,44.45 104.14,44.45 v104.46,44.13
  Bottom 0.152: 44PINEDGE.C 99.72,9.55 102.55,12.38 103.82,12.38 104.46,13.02 v104.46,15.56 v104.46,32.7 v104.46,44.13 v104.46,48.9
ADDR2  (via drill 0.3)
  Top 0.152: IC8.18 110.73,14.68 110.49,14.92 102.87,14.92 v102.55,14.61 | IC2.10 102.87,50.48 v102.55,50.16 | v102.55,32.07 102.23,32.38 89.53,32.38 85.68,28.54 IC1.68 | IC5.26 75.18,41.02 76.52,39.69 80.33,39.69 84.45,43.81 102.23,43.81 v102.55,43.5
  Bottom 0.152: 44PINEDGE.D 95.76,9.72 99.69,13.65 101.92,13.65 102.55,14.29 v102.55,14.61 v102.55,32.07 v102.55,43.5 v102.55,50.16
ADDR3  (via drill 0.3)
  Top 0.152: IC2.9 101.6,51.75 v100.65,50.8 100.33,51.12 81.6,51.12 79.38,48.9 75.25,48.9 74.93,49.21 74.93,50.16 75.18,50.42 IC5.11 | IC8.17 109.6,13.34 102.23,13.34 v100.33,15.24 | v100.65,31.43 100.33,31.75 89.53,31.75 85.82,28.04 IC1.67
  Bottom 0.152: 44PINEDGE.E 91.8,9.88 96.84,14.92 100.01,14.92 v100.33,15.24 100.65,15.56 v100.65,31.43 v100.65,50.8
ADDR4  (via drill 0.3)
  Top 0.152: 110.23,33.08 IC8.16 110.23,32.76 108.27,30.8 99.06,30.8 v98.74,30.48 98.42,30.8 89.22,30.8 85.95,27.54 IC1.66 | IC2.8 99.06,53.02 v98.74,52.7
  Bottom 0.152: 44PINEDGE.F 87.83,9.73 94.3,16.19 98.11,16.19 98.74,16.83 v98.74,30.48 v98.74,52.7
ADDR5  (via drill 0.3)
  Top 0.152: IC8.15 110.73,32.31 108.27,29.84 97.16,29.84 v96.84,29.53 96.52,29.84 88.9,29.84 86.09,27.04 IC1.65 | IC2.7 97.47,54.29 v96.84,53.66
  Bottom 0.152: 44PINEDGE.H 83.87,9.58 91.76,17.46 96.2,17.46 96.84,18.1 v96.84,29.53 v96.84,53.66
ADDR6  (via drill 0.3)
  Top 0.152: IC2.6 95.88,55.56 v94.93,54.61 | IC8.14 111.23,31.86 108.27,28.89 95.25,28.89 v94.93,28.57 94.61,28.89 88.58,28.89 86.22,26.54 IC1.64
  Bottom 0.152: 44PINEDGE.J 79.91,9.74 88.9,18.73 94.3,18.73 94.93,19.37 v94.93,28.57 v94.93,54.61
ADDR7  (via drill 0.3)
  Top 0.152: IC2.5 94.3,56.83 v93.03,55.56 | IC8.13 111.73,31.41 108.27,27.94 93.34,27.94 v93.03,27.62 92.71,27.94 88.27,27.94 86.36,26.04 IC1.63
  Bottom 0.152: 44PINEDGE.K 75.95,9.59 86.36,20 92.39,20 93.03,20.64 v93.03,27.62 v93.03,55.56
ADDR8  (via drill 0.3)
  Top 0.152: IC2.27 121.28,54.29 124.14,51.44 124.14,37.47 118.74,32.07 117.16,32.07 116.73,32.49 IC8.3 116.73,37.26 113.66,40.32 91.44,40.32 v91.12,40.01 90.8,40.32 84.14,40.32 79.83,36.02 IC1.82
  Bottom 0.152: 44PINEDGE.L 71.98,9.44 83.82,21.27 90.49,21.27 91.12,21.91 v91.12,40.01
ADDR9  (via drill 0.3)
  Top 0.152: IC2.26 121.28,53.02 123.51,50.8 123.51,37.78 118.43,32.7 117.47,32.7 117.23,32.95 IC8.2 117.23,37.71 113.66,41.27 90.49,41.27 v90.17,40.96 89.85,41.27 84.45,41.27 78.33,35.16 IC1.85
  Bottom 0.152: 44PINEDGE.M 68.02,9.6 80.33,21.91 89.53,21.91 90.17,22.54 v90.17,40.96
ADDR10  (via drill 0.3)
  Top 0.152: IC8.31 117.23,19.61 111.12,25.72 89.53,25.72 v89.22,25.4 88.9,25.72 87.95,25.72 86.27,24.04 IC1.59 | IC2.23 117.47,49.21 110.49,56.2 95.57,56.2 94.3,54.93 89.53,54.93 v89.22,54.61
  Bottom 0.152: 44PINEDGE.N 64.06,9.77 77.47,23.18 88.58,23.18 89.22,23.81 v89.22,25.4 v89.22,54.61
ADDR11  (via drill 0.3)
  Top 0.152: IC8.1 117.73,38.16 113.66,42.23 | 113.66,42.23 88.58,42.23 v88.27,41.91 | IC2.25 121.28,51.75 122.87,50.16 122.87,44.13 120.97,42.23 113.66,42.23 | IC1.58 83.14,23.54 v82.55,24.13
  Bottom 0.152: 44PINEDGE.P 60.1,10.25 73.98,24.13 v82.55,24.13 87.63,24.13 88.27,24.77 v88.27,41.91
ADDR12  (via drill 0.3)
  Top 0.152: IC2.4 110.49,60.01 113.35,62.87 122.87,62.87 129.22,56.52 129.22,34.92 121.28,26.99 108.27,26.99 | 108.27,26.99 87.95,26.99 85.99,25.04 IC1.61 82.28,25.04 v81.91,25.4 | 108.27,26.99 112.23,30.95 IC8.12
  Bottom 0.152: 44PINEDGE.R 56.13,9.46 71.75,25.08 81.6,25.08 v81.91,25.4
ADDR13  (via drill 0.3)
  Top 0.152: IC1.25 65.75,20.04 v65.72,20
  Bottom 0.152: 44PINEDGE.S 52.17,9.63 62.55,20 v65.72,20
BADDR13
  Top 0.152: IC2.28 121.28,55.56 124.78,52.07 124.78,37.15 119.06,31.43 116.84,31.43 116.23,32.04 IC8.4 116.23,36.8 113.66,39.37 83.82,39.37 80.33,35.88 IC1.81
BADDR14
  Top 0.152: IC2.29 121.28,56.83 125.41,52.7 125.41,36.83 119.38,30.8 116.52,30.8 115.73,31.59 IC8.5 115.73,36.35 113.35,38.73 84.14,38.73 81.33,35.93 IC1.79
BADDR15
  Top 0.152: IC2.3 111.76,60.01 113.98,62.23 122.24,62.23 128.59,55.88 128.59,35.24 120.97,27.62 113.98,27.62 112.73,28.87 IC8.11 112.73,34.59 111.76,35.56 90.8,35.56 85.78,30.54 IC1.72
BADDR16
  Top 0.152: IC2.2 113.03,60.01 114.62,61.59 121.6,61.59 127.95,55.24 127.95,35.56 120.65,28.26 114.3,28.26 113.23,29.32 IC8.10 113.23,35.04 112.08,36.2 90.8,36.2 86.14,31.54 IC1.74
BADDR17
  Top 0.152: IC2.30 120.73,58.65 126.05,53.34 126.05,36.51 119.7,30.16 116.2,30.16 115.23,31.14 IC8.6 115.23,35.9 113.03,38.1 84.14,38.1 81.83,35.8 IC1.78
BADDR18
  Top 0.152: IC2.1 114.3,60.01 115.25,60.96 120.97,60.96 127.32,54.61 127.32,35.88 120.33,28.89 114.62,28.89 113.73,29.78 IC8.9 113.73,35.49 112.39,36.83 84.14,36.83 82.83,35.53 IC1.76
CR/!W  (via drill 0.3)
  Top 0.152: IC1.23 68.02,21.04 67.94,20.95 v66.67,20.95 | IC5.16 72.71,48.26 72.39,47.94 72.39,46.23 | 72.39,46.23 IC5.20 | v72.39,41.91 72.39,46.23 | 44PINEDGE.18 40.28,11.07 v40.96,11.75 40.96,30.16 v41.91,31.11
  Bottom 0.152: v72.39,41.91 72.39,40.64 67.94,36.2 46.99,36.2 v41.91,31.11 | v40.96,11.75 50.16,20.95 v66.67,20.95
CTS  (via drill 0.3)
  Top 0.152: IC5.38 79.63,44.7 79.38,44.45 78.74,44.45 78.1,45.09 76.2,45.09 v75.56,44.45
  Bottom 0.152: v75.56,44.45 74.93,43.81 50.8,43.81 46.99,40.01 IC11.9
DATA0  (via drill 0.3)
  Top 0.152: 44PINEDGE.2 103.68,11.29 v103.82,11.43 | IC8.21 112.23,16.04 110.49,17.78 105.73,17.78 v105.41,17.46 105.09,17.78 86.04,17.78 83.5,15.24 80.01,15.24 78.33,16.91 IC1.41 | IC5.43 82.3,47.24 83.5,46.04 105.09,46.04 v105.41,45.72 105.73,46.04 106.68,46.04 107.31,46.67 IC2.13
  Bottom 0.152: v103.82,11.43 104.46,11.43 105.41,12.38 v105.41,17.46 v105.41,45.72
DATA1  (via drill 0.3)
  Top 0.152: 44PINEDGE.3 99.72,11.4 v99.69,11.43 | IC8.22 112.73,16.49 110.49,18.73 103.82,18.73 v103.5,18.41 103.19,18.73 86.36,18.73 83.5,15.88 80.01,15.88 78.83,17.05 IC1.42 | IC2.14 110.49,46.67 109.85,47.31 107.31,47.31 107,46.99 103.82,46.99 v103.5,46.67 103.19,46.99 83.18,46.99 82.42,47.75 IC5.44
  Bottom 0.152: v99.69,11.43 101.28,13.02 102.87,13.02 103.5,13.65 v103.5,18.41 v103.5,46.67
DATA2  (via drill 0.3)
  Top 0.152: 44PINEDGE.4 95.76,11.3 v95.88,11.43 | IC8.23 113.23,16.94 110.49,19.68 101.92,19.68 v101.6,19.37 101.28,19.68 86.68,19.68 83.5,16.51 82.87,16.51 82.33,17.04 IC1.49 | IC5.45 101.28,48.26 v101.6,47.94 101.92,48.26 105.41,48.26 105.73,48.58 110.17,48.58 111.76,46.99 IC2.15
  Bottom 0.152: v95.88,11.43 98.74,14.29 100.96,14.29 101.6,14.92 v101.6,19.37 v101.6,47.94
DATA3  (via drill 0.3)
  Top 0.152: 44PINEDGE.5 91.8,11.15 v92.07,11.43 | IC8.25 114.23,16.89 110.49,20.64 100.01,20.64 v99.69,20.32 99.38,20.64 86.99,20.64 84.39,18.04 IC1.50 | IC5.46 82.42,48.77 82.87,49.21 99.38,49.21 v99.69,48.9 100.01,49.21 103.19,49.21 103.82,49.85 110.49,49.85 114.3,46.04 IC2.17
  Bottom 0.152: v92.07,11.43 96.2,15.56 99.06,15.56 99.69,16.19 v99.69,20.32 v99.69,48.9
DATA4  (via drill 0.3)
  Top 0.152: 44PINEDGE.6 87.83,11.32 v87.95,11.43 | IC8.26 114.73,17.35 110.49,21.59 98.11,21.59 v97.79,21.27 97.47,21.59 87.31,21.59 86.26,20.54 IC1.52 | IC5.47 82.3,49.28 83.18,50.16 97.47,50.16 v97.79,49.85 98.11,50.16 100.96,50.16 101.92,51.12 110.49,51.12 115.57,46.04 IC2.18
  Bottom 0.152: v87.95,11.43 93.34,16.83 97.16,16.83 97.79,17.46 v97.79,21.27 v97.79,49.85
DATA5  (via drill 0.3)
  Top 0.152: 44PINEDGE.7 83.87,11.16 v84.14,11.43 | IC8.27 115.23,17.8 110.49,22.54 96.2,22.54 v95.88,22.23 | IC5.2 79.76,51.82 80.01,52.07 95.57,52.07 v95.88,51.75 96.2,52.07 100.01,52.07 100.33,52.39 110.49,52.39 116.84,46.04 IC2.19 | v95.88,22.23 95.57,22.54 | v95.88,22.23 95.57,22.54 87.63,22.54 86.12,21.04 IC1.53
  Bottom 0.152: v84.14,11.43 90.8,18.1 95.25,18.1 95.88,18.73 v95.88,22.23 v95.88,51.75
DATA6  (via drill 0.3)
  Top 0.152: 44PINEDGE.8 79.91,11.33 v80.01,11.43 | IC8.28 115.73,18.25 110.49,23.5 94.3,23.5 v93.98,23.18 93.66,23.5 87.95,23.5 85.99,21.54 IC1.54 | IC5.3 79.25,51.94 80.33,53.02 93.66,53.02 v93.98,52.7 94.3,53.02 97.47,53.02 98.11,53.66 110.49,53.66 118.11,46.04 IC2.20
  Bottom 0.152: v80.01,11.43 87.95,19.37 93.34,19.37 93.98,20 v93.98,23.18 v93.98,52.7
DATA7  (via drill 0.3)
  Top 0.152: 44PINEDGE.9 75.95,11.18 v76.2,11.43 | IC8.29 116.23,18.7 110.49,24.45 92.39,24.45 v92.07,24.13 91.76,24.45 89.85,24.45 89.53,24.13 87.95,24.13 85.85,22.04 IC1.55 | IC5.4 78.74,52.07 80.64,53.98 91.76,53.98 v92.07,53.66 92.39,53.98 95.25,53.98 96.2,54.93 110.49,54.93 118.74,46.67 IC2.21
  Bottom 0.152: v76.2,11.43 85.41,20.64 91.44,20.64 92.07,21.27 v92.07,24.13 v92.07,53.66
DCD  (via drill 0.3)
  Top 0.152: v77.15,45.72 IC5.40 | IC11.12 26.04,47.62 27.3,48.9 v41.91,48.9
  Bottom 0.152: v77.15,45.72 45.09,45.72 v41.91,48.9
DSR  (via drill 0.3)
  Top 0.152: IC5.39 79.18,45.21 v79.06,45.09
  Bottom 0.152: v79.06,45.09 77.15,43.18 51.44,43.18 34.29,26.04 IC12.12
DTR  (via drill 0.3)
  Top 0.152: IC5.33 78.74,43.81 78.1,44.45 v76.52,44.45 | IC11.11 v41.91,45.09
  Bottom 0.152: v41.91,45.09 75.88,45.09 v76.52,44.45
EIA_CTS
  Top 0.152: X5.9 28.27,60.55 R10.1
  Bottom 0.152: IC11.8 18.41,40.01 20,41.59 20,56.2 28.27,64.47 X5.9
EIA_DCD
  Top 0.152: R14.1 33.76,60.32 X5.7
  Bottom 0.152: IC11.13 26.04,50.16 30.48,54.61 30.48,61.28 33.76,64.55 X5.7
EIA_DSR
  Top 0.152: R13.1 37.87,60.31 X5.1
  Bottom 0.152: X5.1 33.66,60.87 33.66,53.98 26.04,46.35 23.49,46.35 21.91,44.77 21.91,30.16 23.49,28.57 IC12.13
EIA_DTR
  Bottom 0.152: IC11.14 26.04,52.7 29.21,55.88 29.21,64.66 X5.4
EIA_RTS
  Bottom 0.152: IC11.7 18.41,42.55 19.05,43.18 19.05,57.47 25.4,63.82 25.4,66.99 27.62,69.22 30.48,69.22 31.01,68.68 X5.8
EIA_RXD
  Bottom 0.152: X5.2 31.11,61.07 31.11,53.98 26.04,48.9 23.49,48.9 20.95,46.35 20.95,20.95 18.41,18.41 IC12.8
EIA_TXD
  Bottom 0.152: IC12.14 23.49,31.11 22.86,31.75 22.86,43.18 23.49,43.81 26.04,43.81 36.2,53.98 36.2,61.59 39.37,64.77 39.37,68.58 38.73,69.22 33.02,69.22 32.39,68.58 X5.3
GND  (via drill 0.3)
  Top 0.152: IC1.43 79.33,19.41 v79.06,19.68 | IC1.44 79.83,16.68 80.01,16.51 80.64,16.51 80.83,16.7 IC1.46
  Top 1.778: 44PINEDGE.A 107.62,11.11 | 44PINEDGE.22 24.45,4.7 v24.45,12.06
  Bottom 1.778: 44PINEDGE.A 107.62,11.11 | 44PINEDGE.22 24.46,12.06
  other vias: 107.63,11.43 113.03,46.35 83.82,33.02 69.85,33.02 69.85,18.73 83.18,19.68 71.75,20.32 82.23,20.64 82.23,31.43 71.44,31.43 71.75,47.62 74.61,47.62 79.38,30.16 120.65,64.77 119.38,19.68 71.44,26.35 82.23,26.35 78.1,32.38 54.29,48.26 44.77,54.61 44.77,48.26 54.29,54.61
  pour Top (isolate 0.178): 20.95,75.56 20.95,70.48 0,70.48 0,11.11 132.08,11.11 132.08,70.48 111.12,70.48 111.12,75.56
  pour Bottom (isolate 0.178): 0,11.11 132.08,11.11 132.08,70.48 111.12,70.48 111.12,75.56 20.95,75.56 20.95,70.48 0,70.48
IO_SEL  (via drill 0.3)
  Top 0.152: S1.2 6.99,38.1 6.35,37.47 6.35,34.6 R25.2 | IC1.15 42.18,25.04 v41.91,24.77
  Bottom 0.152: S1.2 6.99,38.1 6.35,37.47 6.35,23.5 13.97,15.88 33.02,15.88 v41.91,24.77
MEM_EN  (via drill 0.3)
  Top 0.152: S2.2 6.99,46.99 5.4,45.4 R23.1 | IC1.16 42.95,24.54 v41.91,23.5
  Bottom 0.152: S2.2 6.99,46.99 5.08,45.09 5.08,22.23 12.7,14.61 33.02,14.61 v41.91,23.5
MIDI_RXD
  Top 0.152: 43.82,52.7 39.37,52.7 37.47,54.61 OK1.6 | 43.82,52.7 46.36,52.7 46.99,53.34 IC7.13 46.99,58.2 47.21,57.99 R4.1 | 43.82,52.7 43.82,47.62 46.36,45.09 66.67,45.09 73.33,38.42 IC1.95
MIDI_TXD
  Top 0.152: IC1.94 73.83,38.88 66.99,45.72 52.07,45.72 50.8,46.99 IC7.5
N$1
  Top 0.152: X3.5 103.19,58.1 R9.2
N$2
  Top 0.152: IC7.6 IC7.9
N$3
  Top 0.152: R8.1 X3.4
N$4
  Top 0.152: R9.1 87.31,58.1 85.72,56.52 53.98,56.52 53.34,55.88 IC7.8
N$5
  Top 0.152: R15.2 LED1.A
N$6  (via drill 0.3)
  Top 0.152: v39.69,60.33 R5.1
  Bottom 0.152: D1.C 32.39,43.18 34.93,45.72 OK1.2 34.93,48.58 38.73,52.39 38.73,59.37 v39.69,60.33
N$7
  Top 0.152: R5.2 X1.4
N$8
  Bottom 0.152: D1.A 40.01,43.18 37.47,45.72 OK1.3 37.47,48.26 39.37,50.16 53.98,50.16 X1.5
N$9
  Top 0.152: OK1.7 34.93,54.61 32.28,51.97 R7.1
N$10
  Top 0.152: R2.2 82.23,57.78 X2.5
N$11
  Top 0.152: IC7.10 50.8,55.88 52.71,57.78 R2.1
N$12
  Top 0.152: IC7.11 IC7.12
N$13
  Top 0.152: R1.1 X2.4
N$15
  Top 0.152: R3.1 62.02,49.11 62.87,48.26 72.07,48.26 72.58,48.77 IC5.15
N$16
  Top 0.152: C1.1 Q1.1 67.69,49.53 R6.1 67.78,49.28 IC5.14
N$17
  Top 0.152: R3.2 R6.2 62.02,53.34 Q1.2 C2.1
N$19
  Top 0.152: IC5.12 74.68,51.82 74.93,52.07 78.1,52.07 78.23,51.94 IC5.5
N$25
  Top 0.152: R16.2 LED2.A
N$27  (via drill 0.3)
  Top 0.152: IC1.48 81.83,19.45 79.38,21.91 TCK.TP
  other vias: 79.38,28.57
N$31  (via drill 0.3)
  Top 0.152: IC1.47 81.33,19.31 78.1,22.54 TMS.TP
  other vias: 78.1,27.62
N$32  (via drill 0.3)
  Top 0.152: IC1.45 80.33,19.36 77.47,22.23 77.47,28.89 TDI.TP
  other vias: 78.1,29.53
N$33  (via drill 0.3)
  Top 0.152: IC1.83 79.33,32.11 TDO.TP
  other vias: 79.38,32.07
N$36
  Top 0.406: IC12.1 16.13,36.2 C3.+
N$37
  Top 0.406: IC12.3 13.59,31.11 C3.-
N$38
  Top 0.406: IC12.4 13.59,28.57 C4.+
N$39
  Top 0.406: IC12.5 13.59,26.04 C4.-
N$40
  Bottom 0.406: IC12.2 16.13,33.66 C5.+
N$41
  Top 0.406: IC12.6 13.59,23.5 C6.-
N$42
  Top 0.406: IC11.1 16.13,57.78 C7.+
N$43
  Top 0.406: IC11.3 13.59,52.7 C7.-
N$44
  Top 0.305: 13.59,50.16 13.67,50.16
  Top 0.406: 13.67,50.16 IC11.4 | C8.+ 13.59,50.16
N$45
  Top 0.406: C8.- 13.59,47.62 IC11.5
N$46
  Bottom 0.406: IC11.2 16.13,55.24 C9.+
N$47
  Top 0.406: IC11.6 13.59,45.09 C10.-
OUT1  (via drill 0.3)
  Top 0.152: IC5.34 79.25,41.78 v79.06,41.59 | IC1.92 74.83,37.05 v74.93,37.15
  Bottom 0.152: v79.06,41.59 74.93,37.47 v74.93,37.15
PE  (3 unrouted)
PHI2  (via drill 0.3)
  Top 0.152: IC5.10 75.69,49.66 v75.56,49.53 | IC1.22 68,21.54 67.94,21.59 v65.72,21.59 | v40.28,12.34 40.28,30.76 v40.64,31.11
  Bottom 0.152: 44PINEDGE.V v40.28,12.34 49.53,21.59 v65.72,21.59 | v75.56,49.53 79.69,45.4 79.69,44.13 78.1,42.55 52.07,42.55 v40.64,31.11
REG_BASE0
  Top 0.152: R22.2 58.48,39.75 58.48,38.04 59.05,37.47 59.56,37.47 BASE0.2 64.99,32.03 IC1.1
REG_BASE1
  Top 0.152: BASE1.2 57.27,37.22 | R21.2 55.88,39.69 55.88,38.1 56.64,37.34 BASE1.2 | IC1.3 63.45,31.04 BASE1.2
REG_BASE2
  Top 0.152: R20.2 53.34,39.69 53.34,38.1 54.1,37.34 BASE2.2 61.41,30.54 IC1.4
REG_BASE3
  Top 0.152: R19.2 50.8,39.69 50.8,38.1 51.56,37.34 BASE3.2 59.87,29.54 IC1.6
REG_BASE4
  Top 0.152: R18.2 48.26,39.69 48.26,38.1 49.02,37.34 BASE4.2 58.33,28.54 IC1.8
REG_BASE5
  Top 0.152: R17.2 45.72,39.69 45.72,38.1 46.48,37.34 BASE5.2 56.29,28.04 IC1.9
REG_BASE6
  Top 0.152: R24.2 43.18,39.69 43.18,38.1 43.94,37.34 BASE6.2 54.25,27.54 IC1.10
RS232_RXD
  Top 0.152: IC1.96 72.83,37.97 66.36,44.45 26.67,44.45 26.04,43.81 23.49,43.81 20.95,41.27 20.95,20.95 23.49,18.41 IC12.9
RS232_TXD
  Top 0.152: IC1.97 72.33,37.52 66.04,43.81 28.57,43.81 26.04,41.27 23.49,41.27 22.22,40.01 22.22,24.77 23.49,23.5 IC12.11
RTS  (via drill 0.3)
  Top 0.152: IC5.32 78.23,43.69 78.1,43.81 75.25,43.81 v74.61,44.45
  Bottom 0.152: v74.61,44.45 50.16,44.45 46.99,41.27 27.3,41.27 26.04,42.55 IC11.10
RXD  (via drill 0.3)
  Top 0.152: IC5.7 77.22,50.74 v78.42,49.53 | IC1.87 77.33,35.74 v78.74,37.15
  Bottom 0.152: v78.74,37.15 81.91,40.32 81.91,46.04 v78.42,49.53 78.42,67.63 74.61,71.44 27.94,71.44 24.13,67.63 24.13,64.45 23.18,63.5 12.7,63.5 LED2.K
TXD  (via drill 0.3)
  Top 0.152: IC5.8 76.71,50.29 v77.47,49.53 | IC1.89 76.33,35.7 v77.79,37.15
  Bottom 0.152: v77.79,37.15 81.28,40.64 81.28,45.72 v77.47,49.53 77.47,67.63 74.3,70.8 28.26,70.8 24.76,67.31 24.76,64.14 23.49,62.87 8.89,62.87 LED1.K
UART_CE  (via drill 0.3)
  Top 0.152: IC5.9 76.2,49.85 v76.52,49.53 | IC1.90 75.83,36.15 v76.83,37.15
  Bottom 0.152: v76.52,49.53 80.64,45.4 80.64,40.96 v76.83,37.15
UART_EN  (via drill 0.3)
  Top 0.152: S3.2 6.99,55.88 6.35,56.52 6.35,59.69 7.4,60.74 R12.1 | IC1.17 43.72,24.04 v41.91,22.23
  Bottom 0.152: S3.2 4.45,55.88 2.54,53.98 2.54,22.54 11.75,13.34 33.02,13.34 v41.91,22.23
UART_IRQ  (via drill 0.3)
  Top 0.152: IC5.30 77.22,41.66 v77.15,41.59 | 74.83,39.27 v74.93,39.37 74.33,38.77 IC1.93
  Bottom 0.152: v74.93,39.37 v77.15,41.59
UART_RESET  (via drill 0.3)
  Top 0.152: v75.88,37.15 75.33,36.6 IC1.91 | IC5.35 79.76,41.85 v80.01,41.59
  Bottom 0.152: v75.88,37.15 80.01,41.27 v80.01,41.59
VCC  (via drill 0.3)
  Top 0.152: R8.2 90.59,62.97 92.07,64.45 93.34,64.45 100.01,71.12 | 9.21,62.02 R16.1 R15.1 | 45.72,57.78 45.72,58.2 45.51,57.99 R4.2 | 9.21,62.02 10.06,62.02 12.06,60.01 | 11.75,30.48 11.43,30.8 R25.1 | 43.18,57.89 C14.1 | C17.1 28.4,13.97 R11.2 | R23.2 8.15,30.9 R25.1 | 9.21,62.02 R12.2 | R25.1 8.26,30.48 | R25.1 | R25.1 8.26,31.11 | v115.57,64.77 C18.1 | 33.66,57.89 R14.2 | 29.84,57.78 C13.1
  Top 0.305: 79.38,71.12 72.71,64.45 71.44,64.45 69.85,62.87 69.85,60.33 | 69.85,60.33 v69.85,58.74 | 69.85,60.33 R1.2 | v67.31,46.99 C15.1 | v119.38,24.77 C19.1 | 69.85,71.12 69.53,70.8 | IC8.8 114.23,30.16 v114.3,30.16 | C11.1 35.94,18.41 36.57,19.05 | v74.61,46.74 IC5.19 | v74.61,46.74 75.25,46.74 | v74.61,46.74 IC5.42
  Top 0.61: v115.57,56.83 IC2.32 | 45.72,57.78 IC7.14 | R4.2 45.4,57.89 43.18,57.89 37.47,57.89 | 37.47,57.89 33.66,57.89 32.39,57.89 32.39,57.78 OK1.8 | R13.2 37.47,58.52 37.47,57.89
  Top 0.813: 28.4,10.97 44PINEDGE.21 | 24.76,60.07 24.76,71.12 69.85,71.12 79.38,71.12 100.01,71.12 104.77,71.12 104.77,64.77 v115.57,64.77 | 24.76,60.07 IC11.16 27.94,57.78 | 28.4,10.97 28.43,10.97 | 28.4,16.51 28.4,36.2 IC12.16 | 28.4,16.51 28.4,13.97 28.4,10.97 | 28.4,16.51 11.75,16.51 11.75,30.48 11.75,38.48 | 11.75,38.48 C5.- | 11.75,38.48 11.75,60.01 12.06,60.01 13.34,60.01 C9.- 24.76,60.07 | 28.4,16.51 36.57,16.51 36.57,19.05 VR1.3 | 27.94,57.78 29.84,57.78 32.39,57.78 | 27.94,57.78 R10.2
  Bottom 0.305: v119.38,24.77 114.3,29.84 v114.3,30.16 | v67.31,46.99 67.31,46.74 69.85,46.74 | 69.85,46.74 v74.61,46.74 | v69.85,58.74 69.85,46.74
  Bottom 0.61: v115.57,56.83 115.57,31.43 v114.3,30.16
  Bottom 0.813: v115.57,64.77 v115.57,56.83
VDD  (via drill 0.3)
  Top 0.152: C16.1 68.58,36.51 | R18.1 49.85,42.86 50.16,42.55 49.84,42.55 R18.1
  Top 0.305: 70.83,20.04 IC1.26 70.83,23.04 76.83,23.04 | 76.83,32.38 IC1.88 | 76.83,32.38 71.83,32.38 IC1.98 71.83,35.8 71.12,36.51 68.58,36.51 | 76.83,31.11 76.83,30.04 | 76.83,32.38 76.83,31.11 | 83.5,23.04 IC1.57 | 76.83,23.04 IC1.38 | 76.83,30.04 IC1.5 | 76.83,30.04 76.83,23.04 | IC1.51 83.79,20.04 83.5,20.32 83.5,23.04 | C16.1 65.09,36.19 61.59,39.69 61.59,42.86 R22.1 R21.1 R20.1 R19.1 R18.1 R17.1 R24.1 43.18,42.86 35.24,34.92 C12.1 35.24,30 VR1.4 | 83.5,23.04 80.64,23.04 80.64,31.11 3V3.TP 76.83,31.11
  other vias: 78.1,31.11

### Text on the board
tPlace: (c) 2015 RETRO Innovations
tNames: C:/Users/brain/Desktop/Untitled - 1.bmp